# EasyEDA Pro project 16省.epro

# Schematic ESP_MCB_SCH

## Sheets
1 ESP32: Board Name: ESP_MCB; Create Date: 2025-03-12; Page Name: ESP32; Project Name: 16P1D_EDA; Schematic Name: ESP_MCB_SCH; Update Date: 2025-03-28; Company: 嘉立创EDA; Page Size: A4; Version: V1.0
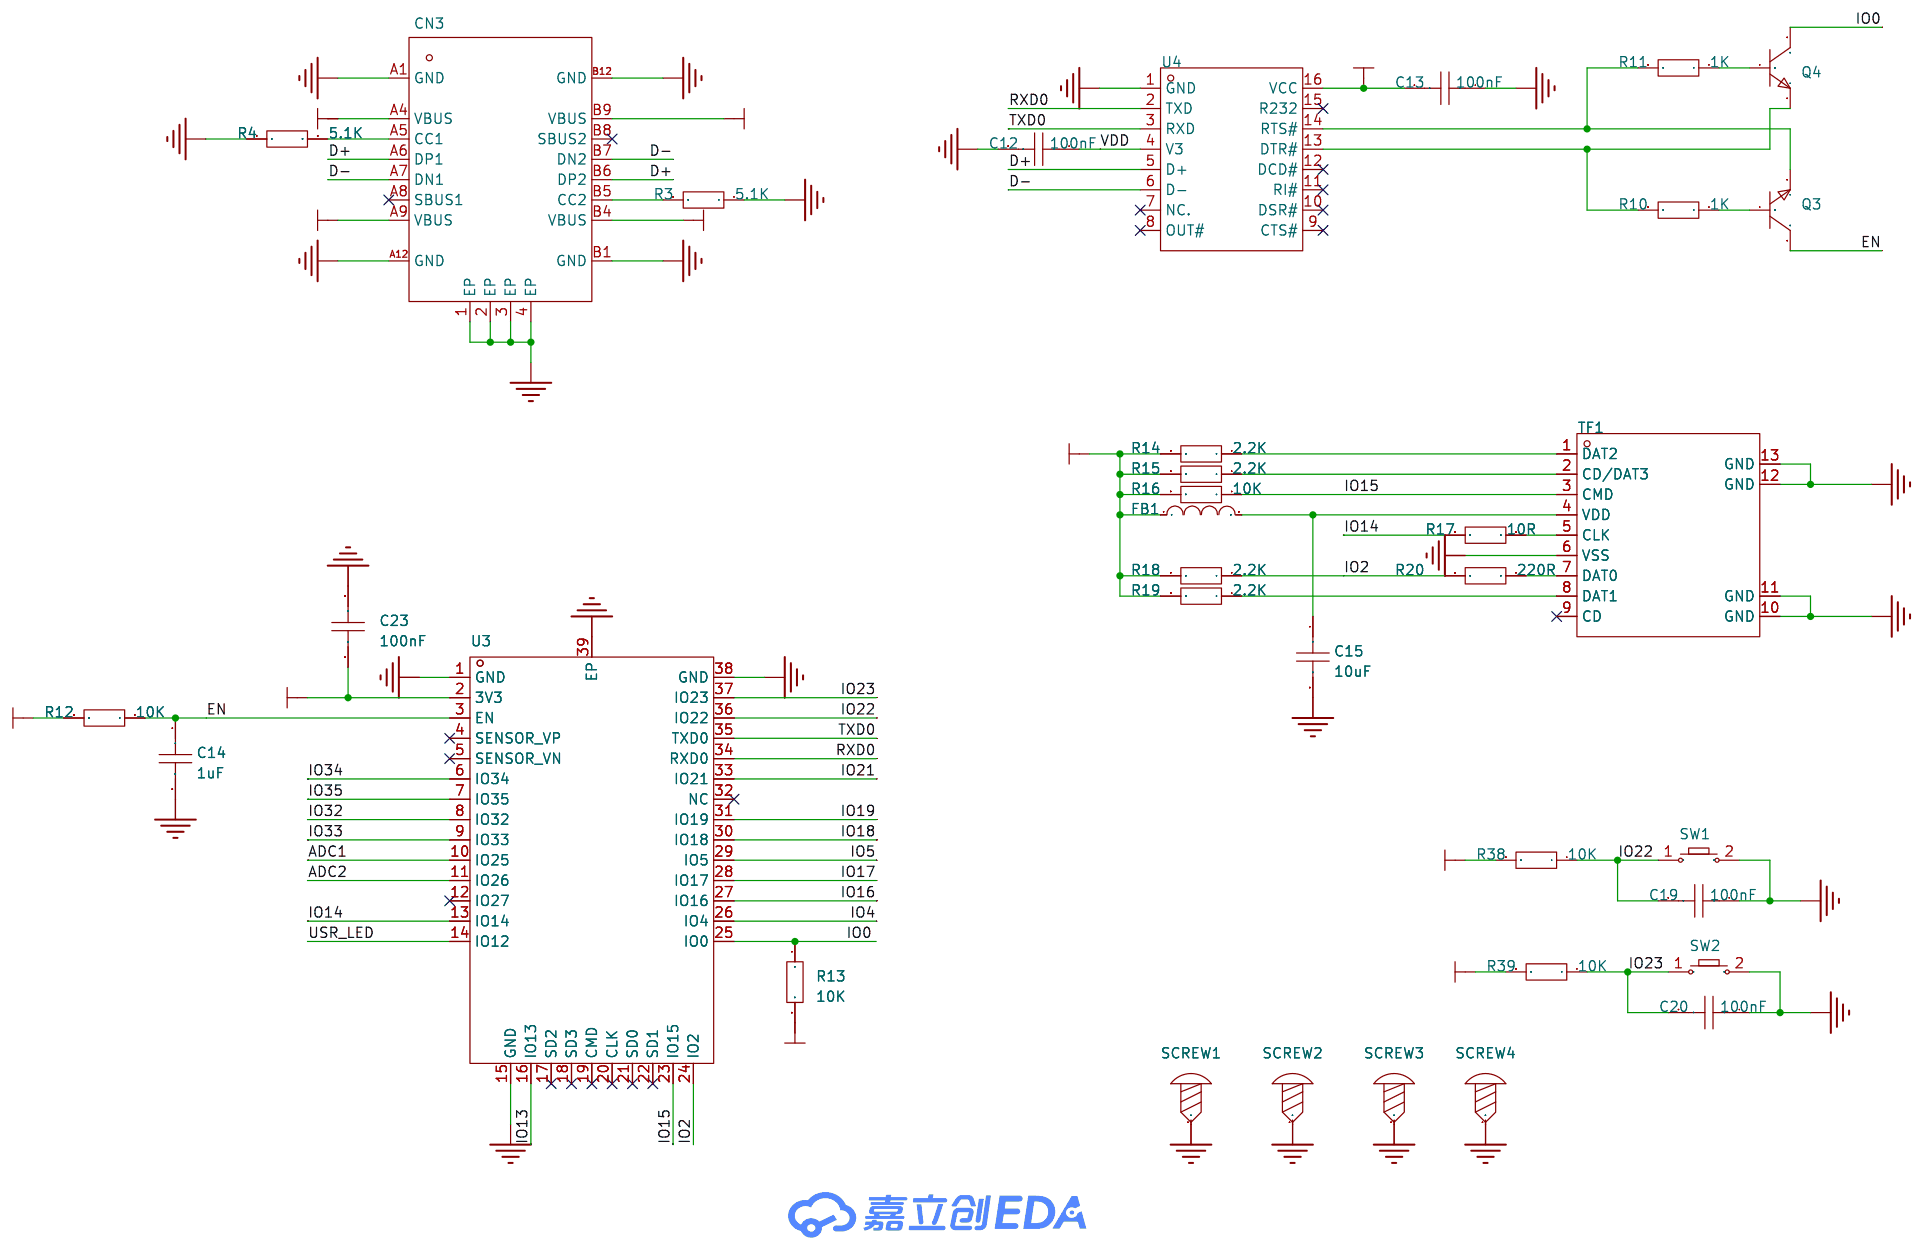
[diagram p0: ESP32]
2 DC: Page Name: DC; Update Date: 2025-03-13
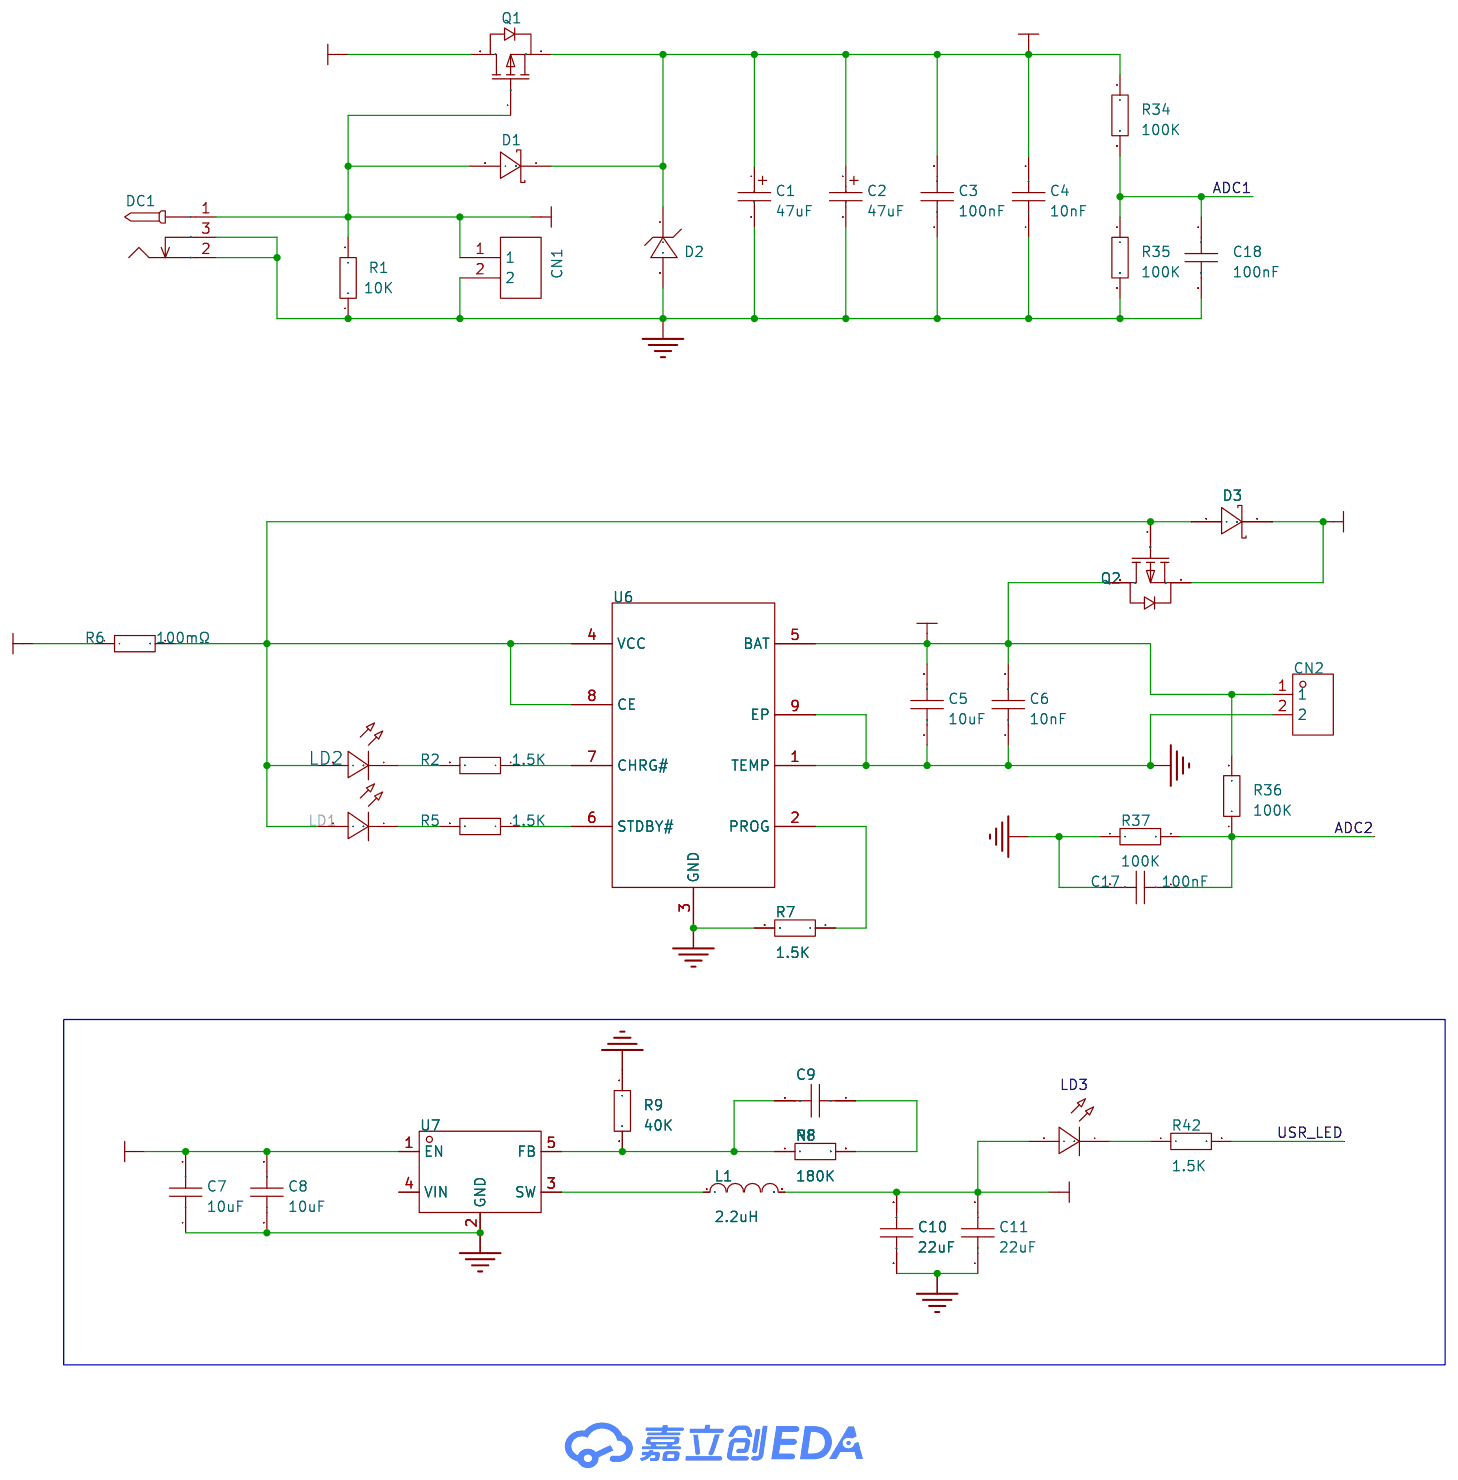
[diagram p1: DC]
3 RELAY: Page Name: RELAY
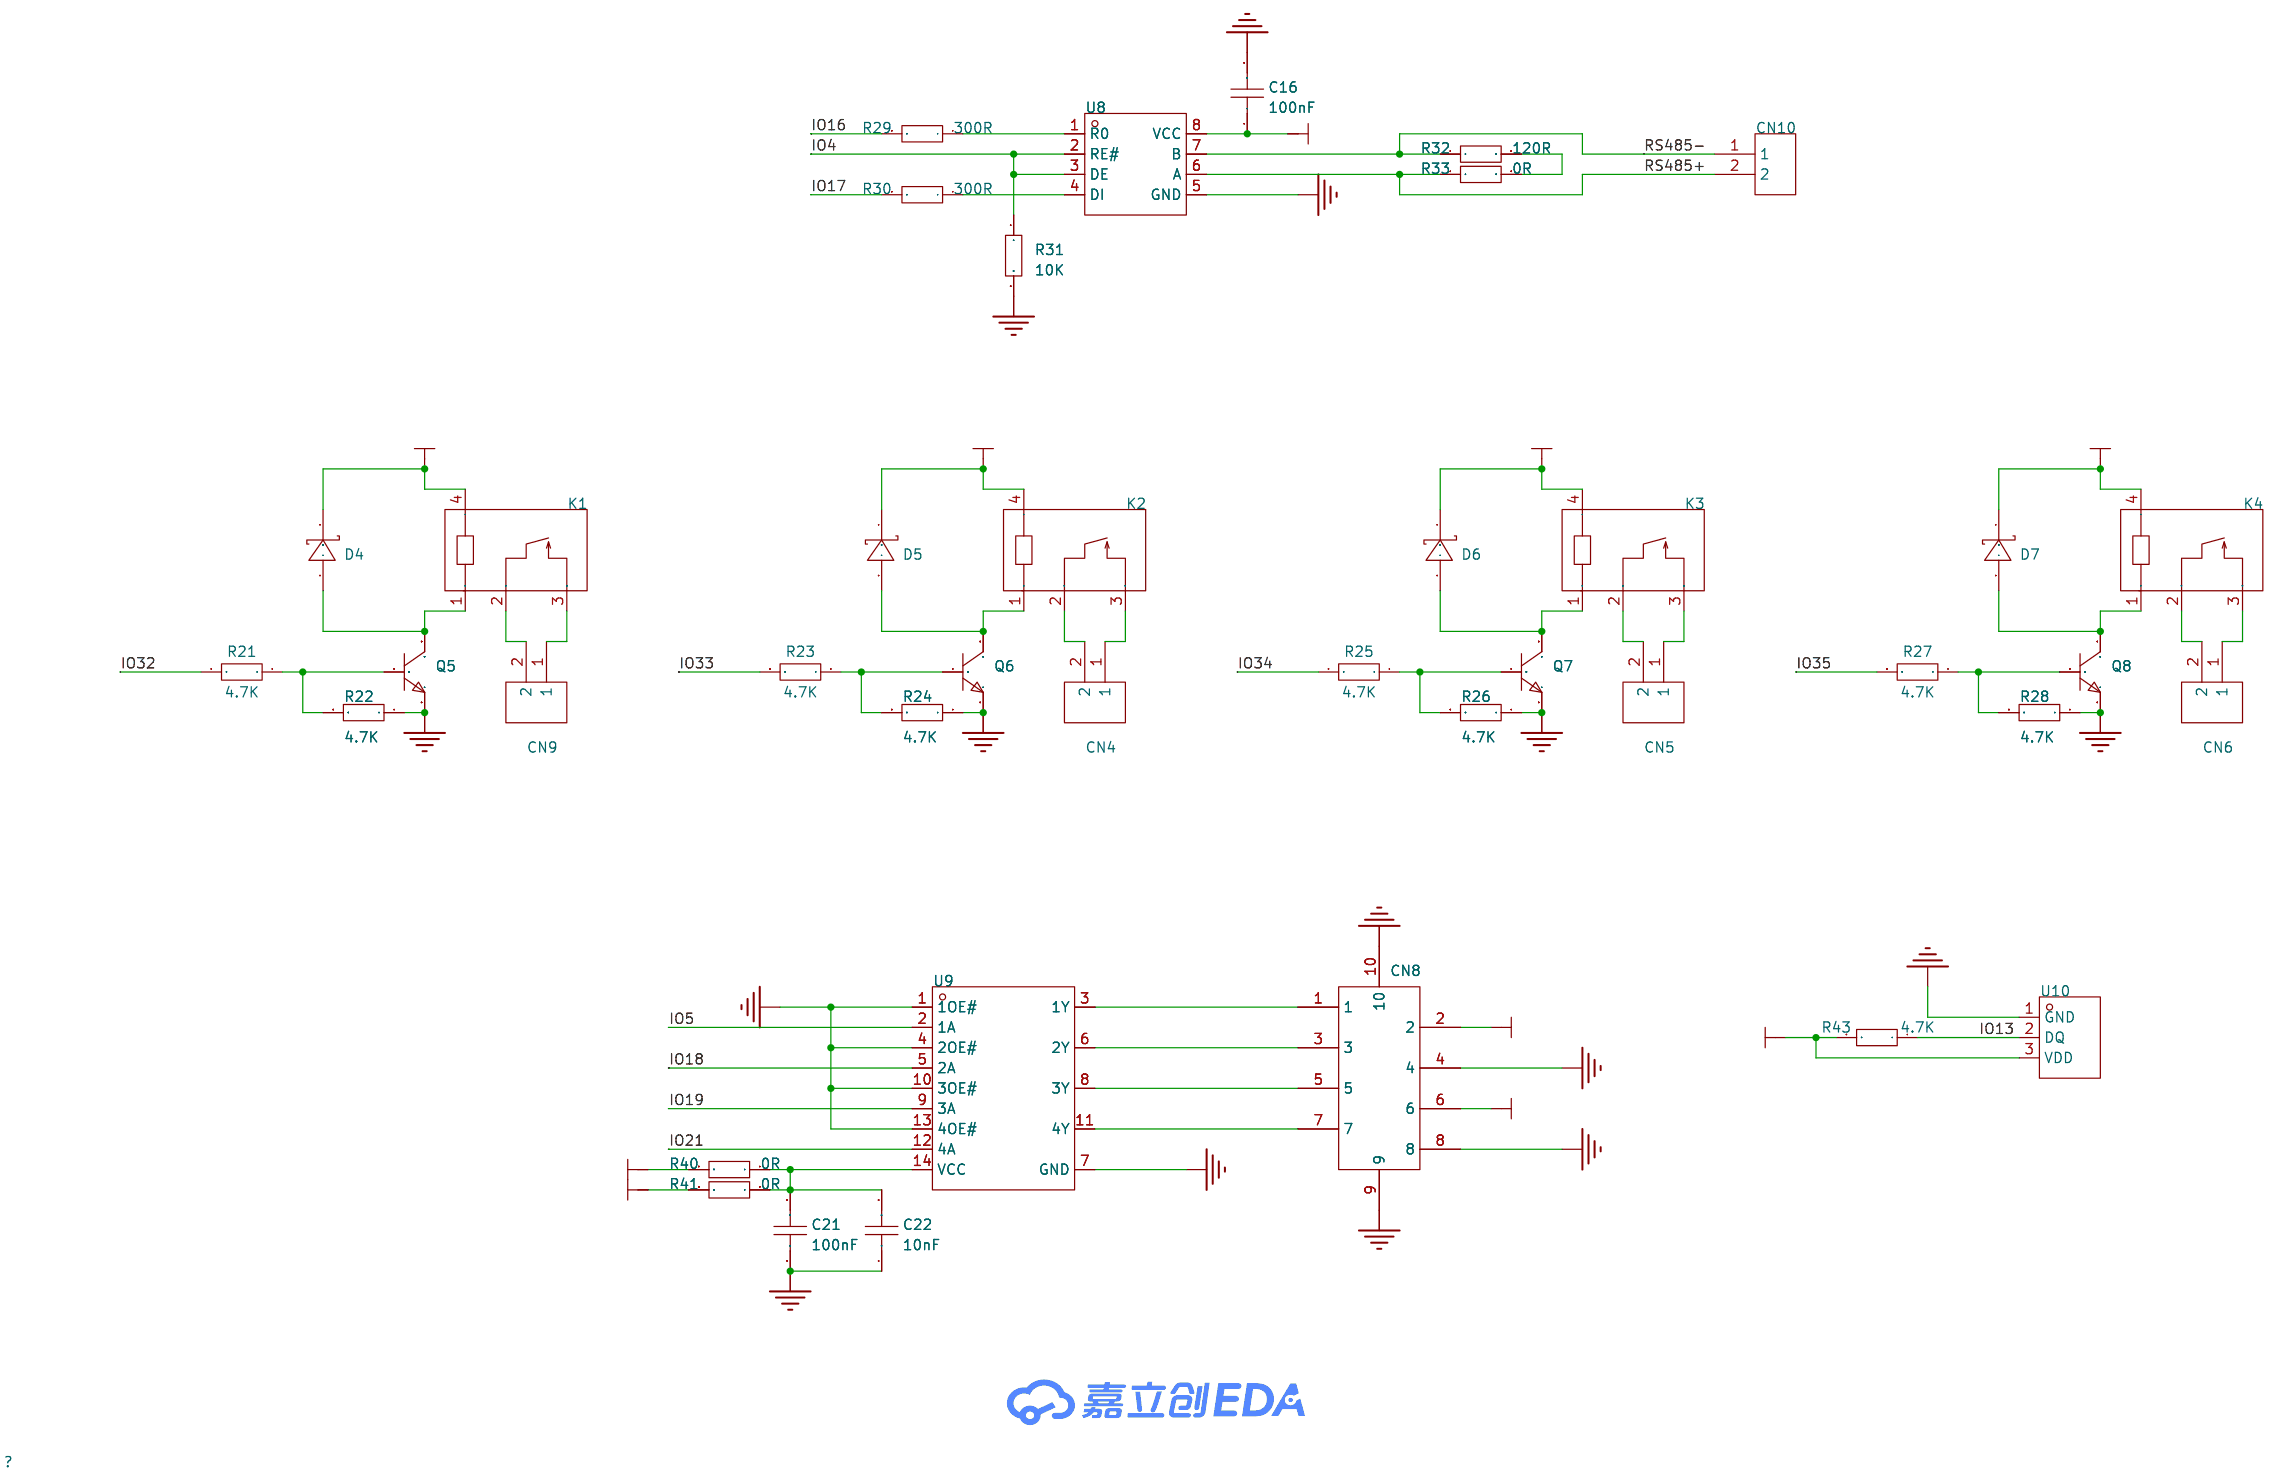
[diagram p2: RELAY]

## Parts
sheet DC
C1  47uF  [C_Ele_SMD_5x5.4mm]
C2  47uF  [C_Ele_SMD_5x5.4mm]
C3  100nF  [C0805]
C4  10nF  [C0805]
C5  10uF  [C0805]
C6  10nF  [C0805]
C7  10uF  [C0805]
C8  10uF  [C0805]
C9  NF  [C0805]
C10  22uF  [C0805]
C11  22uF  [C0805]
C17  100nF  [C0805]
C18  100nF  [C0805]
CN1  WJ500V-5.08-2P  [CONN-TH_2P-P5.00_WJ500V-5.08-2P]
CN2  ZX-XH2.54-2PZZ  [CONN-TH_2P-P2.50_HX25003-2A]
D1  SS34  [SMC_L6.9-W5.9-LS7.9-RD]
D2  SMBJ6.0A  [SMB_L4.6-W3.6-LS5.3-RD]
D3  SS34  [SMC_L6.9-W5.9-LS7.9-RD]
DC1  -  [DC-005_2.5]
L1  2.2uH  [IND-SMD_L4.4-W4.2]
LD1  -  [LED_0805]
LD2  -  [LED_0805]
LD3  -  [LED_0805]
Q1  AO3401A  [SOT-23_L2.9-W1.3-P1.90-LS2.4-BR]
Q2  AO3401A  [SOT-23_L2.9-W1.3-P1.90-LS2.4-BR]
R1  10K  [R0805]
R2  1.5K  [R0805]
R5  1.5K  [R0805]
R6  100mΩ  [R1210]
R7  1.5K  [R0805]
R8  180K  [R0805]
R9  40K  [R0805]
R34  100K  [R0805]
R35  100K  [R0805]
R36  100K  [R0805]
R37  100K  [R0805]
R42  1.5K  [R0805]
U6  TP4056-42-ESOP8  [ESOP-8_L4.9-W3.9-P1.27-LS6.0-BL-EP]
U7  -  [SOT_XDC]
sheet ESP32
C12  100nF  [C0805]
C13  100nF  [C0805]
C14  1uF  [C0805]
C15  10uF  [C0805]
C19  100nF  [C0805]
C20  100nF  [C0805]
C23  100nF  [C0805]
CN3  -  [USB_TYPE-C-16P]
FB1  10uH  [L0805]
Q3  SS8050  [SOT-23_L2.9-W1.3-P1.90-LS2.4-BR]
Q4  SS8050  [SOT-23_L2.9-W1.3-P1.90-LS2.4-BR]
R3  5.1K  [R0805]
R4  5.1K  [R0805]
R10  1K  [R0805]
R11  1K  [R0805]
R12  10K  [R0805]
R13  10K  [R0805]
R14  2.2K  [R0805]
R15  2.2K  [R0805]
R16  10K  [R0805]
R17  10R  [R0805]
R18  2.2K  [R0805]
R19  2.2K  [R0805]
R20  220R  [R0805]
R38  10K  [R0805]
R39  10K  [R0805]
SCREW1  -  [M2螺丝]
SCREW2  -  [M2螺丝]
SCREW3  -  [M2螺丝]
SCREW4  -  [M2螺丝]
SW1  -  [Key_SMD_3x4x2]
SW2  -  [Key_SMD_3x4x2]
TF1  TF-CARD H1.8  [TF-SMD_TF-CARD-H1.8]
U3  ESP32-WROOM-32  [WIFIM-SMD_ESP-WROOM-32]
U4  CH340C  [SOP-16_L10.0-W3.9-P1.27-LS6.0-BL]
sheet RELAY
C16  100nF  [C0805]
C21  100nF  [C0805]
C22  10nF  [C0805]
CN4  WJ500V-5.08-2P  [CONN-TH_2P-P5.00_WJ500V-5.08-2P]
CN5  WJ500V-5.08-2P  [CONN-TH_2P-P5.00_WJ500V-5.08-2P]
CN6  WJ500V-5.08-2P  [CONN-TH_2P-P5.00_WJ500V-5.08-2P]
CN8  8P-立贴带锁  [FPC-SMD_8P-P0.50_AFC11-S08ICC-00]
CN9  WJ500V-5.08-2P  [CONN-TH_2P-P5.00_WJ500V-5.08-2P]
CN10  WJ500V-5.08-2P  [CONN-TH_2P-P5.00_WJ500V-5.08-2P]
D4  SS34  [SMC_L6.9-W5.9-LS7.9-RD]
D5  SS34  [SMC_L6.9-W5.9-LS7.9-RD]
D6  SS34  [SMC_L6.9-W5.9-LS7.9-RD]
D7  SS34  [SMC_L6.9-W5.9-LS7.9-RD]
K1  G5NB-1A-E-12VDC  [RELAY-TH_G5NB-1A-E-DCXX]
K2  G5NB-1A-E-12VDC  [RELAY-TH_G5NB-1A-E-DCXX]
K3  G5NB-1A-E-12VDC  [RELAY-TH_G5NB-1A-E-DCXX]
K4  G5NB-1A-E-12VDC  [RELAY-TH_G5NB-1A-E-DCXX]
Q5  SS8050  [SOT-23_L2.9-W1.3-P1.90-LS2.4-BR]
Q6  SS8050  [SOT-23_L2.9-W1.3-P1.90-LS2.4-BR]
Q7  SS8050  [SOT-23_L2.9-W1.3-P1.90-LS2.4-BR]
Q8  SS8050  [SOT-23_L2.9-W1.3-P1.90-LS2.4-BR]
R21  4.7K  [R0805]
R22  4.7K  [R0805]
R23  4.7K  [R0805]
R24  4.7K  [R0805]
R25  4.7K  [R0805]
R26  4.7K  [R0805]
R27  4.7K  [R0805]
R28  4.7K  [R0805]
R29  300R  [R0805]
R30  300R  [R0805]
R31  10K  [R0805]
R32  120R  [R0805]
R33  0R  [R0805]
R40  0R  [R0805]
R41  0R  [R0805]
R43  4.7K  [R0805]
U8  MAX485EIM/TR  [SOP-8_L4.9-W3.9-P1.27-LS6.0-BL]
U9  74HC125D/S400118  [SOIC-14_L8.6-W3.8-P1.27-LS6.0-BL]
U10  GX18B20  [TO-92-3_L4.9-W3.7-P1.27-L]

## Library data of the parts
C1 C2 = C_Ele_SMD_5x5.4mm: Supplier Footprint: SMD,5x5.4mm
C3-C23 = CAP_0805: Supplier Footprint: 0805
CN1 CN4-CN6 CN9 CN10 = WJ500V-5.08-2P: 结构:1x2P;间距:5.08mm;颜色:绿色;安装方式:直插;额定电流:18A;额定电压:250V;排数:1;线规 - AWG:14~30;线规 - 平方毫米:2.5;每排PIN数:2;触头材质:-;触头镀层:-;工作温度范围:-40℃~+105℃;焊接温度(最大值):-;; LCSC Part Name: 1x2P 5.08mm 直插 排数:1 每排P数:2; Supplier Part: C8465; Manufacturer: KANGNEX(康奈克斯电气); Supplier Footprint: 插件,P=5.08mm; JLCPCB Part Class: 扩展库; Datasheet: https://atta.szlcsc.com/upload/public/pdf/source/20191225/C8465_02D34CE5B5B4A53DF5891601D97FA9F4.pdf; Supplier: LCSC; Structure: 1x2P; Pitch: 5.08mm; Color: 绿色; Mounting Style: 直插; Current Rating (Max): 18A; Voltage Rating (Max): 250V; Number of Pins: 2P; Number of Rows: 1; Wire Gauge - AWG: 14~30; Wire Gauge - mm2: 2.5; Number of PINs Per Row: 2; Operating Temperature Range: -40℃~+105℃; Screw Specification: M2.5
CN2 = ZX-XH2.54-2PZZ: 插针结构:1x2P;间距:2.5mm;安装方式:直插;参考系列:XH;总PIN数:2P;排数:1;每排PIN数:2;行距:-;额定电流:3A;触头材质:黄铜;触头镀层:锡;工作温度范围:-25℃~+85℃;; LCSC Part Name: 1x2P 间距:2.5mm 直插 系列:XH; Supplier Part: C7429632; Manufacturer: Megastar(兆星); Supplier Footprint: 插件,P=2.5mm; JLCPCB Part Class: 扩展库; Datasheet: https://atta.szlcsc.com/upload/public/pdf/source/20230619/19BA6947230AA44A04D3EDD65E618FD0.pdf; Supplier: LCSC; Pins Structure: 1x2P; Pitch: 2.5mm; Mounting Type: 直插; Reference Series: XH; Number of Pins: 2P; Number of Rows: 1; Number of PINs Per Row: 2; Rated Current: 3A; Contact Material: 黄铜; Contact Plating: 锡; Operating Temperature: -25℃~+85℃; Rated Voltage (Max): 250V; Plastic Material: PA66; Flame Retardant Rating: UL94V-0; Color: 白色; Z-Height of the Board: 7mm; X-Length of Bottom Edge on Board (Spacing Line): 7.5mm; Y-Width of Bottom Edge on Board: 5.9mm
D1 D3-D7 = SS34_C154551: 正向压降(Vf):500mV@3A;直流反向耐压(Vr):40V;整流电流:3A;; LCSC Part Name: 电压:40V 电流:3A; Supplier Part: C154551; Manufacturer: onsemi(安森美); Supplier Footprint: SMC(DO-214AB); JLCPCB Part Class: 扩展库; Datasheet: https://atta.szlcsc.com/upload/public/pdf/source/20230523/C977B907190B075B30FD168351032A84.pdf; Supplier: LCSC; Forward Voltage (Vf@If): 500mV@3A; Reverse Voltage (Vr): 40V; Rectified Current: 3A; Reverse Leakage Current (Ir): 500uA@40V
D2 = SMBJ6.0A_C2987966: 反向截止电压(Vrwm):6V;最大钳位电压:10.3V;峰值脉冲电流(Ipp)@10/1000us:58.3A;峰值脉冲功率(Ppp)@10/1000us:600W;击穿电压:6.67V;; Supplier Part: C2987966; Manufacturer: RUILON(瑞隆源); Supplier Footprint: SMB(DO-214AA); JLCPCB Part Class: 扩展库; Datasheet: https://atta.szlcsc.com/upload/public/pdf/source/20211010/C2833511_00578EBDCC8DA9F5F0AA6629F746BAEA.pdf; Supplier: LCSC; Reverse Stand-Off Voltage (Vrwm): 6V; Maximum Clamping Voltage: 10.3V; Peak Pulse Current (Ipp)@10/1000us: 58.3A; Peak Pulse Power Dissipation (Ppp)@10/1000us: 600W; Breakdown Voltage: 6.67V; Reverse Leakage Current (Ir): 800uA; Type: TVS
DC1 = DC-005_2.5: Supplier Footprint: 插件
L1 = FXL0420-2R2-M: 电感值:2.2uH;精度:±20%;额定电流:4.5A;饱和电流(Isat):5A;类型:一体成型电感;; LCSC Part Name: 2.2uH ±20% 5A; Supplier Part: C167206; Manufacturer: cjiang(长江微电); Supplier Footprint: SMD,4.2x4.4mm; JLCPCB Part Class: 扩展库; Datasheet: https://atta.szlcsc.com/upload/public/pdf/source/20240426/3189EA8206330E2108542F9E34E540E7.pdf; Supplier: LCSC; Tolerance: ±20%; Rated Current: 4.5A; Saturation Current (Isat): 5A; DC Resistance (DCR): 58mΩ; Type: 一体成型电感
LD1 = LED_0805-G: Supplier Footprint: 0805
LD2 = LED_0805-R: Supplier Footprint: 0805
LD3 = LED_0805-B: Supplier Footprint: 0805
Q1 Q2 = AO3401A_C15127: 类型:1个P沟道;漏源电压(Vdss):30V;连续漏极电流(Id):4A;导通电阻(RDS(on)@Vgs,Id):44mΩ@10V,4.3A;功率(Pd):1.4W;阈值电压(Vgs(th)@Id):1.3V@250uA;; LCSC Part Name: 1个P沟道 耐压:30V 电流:4A; Supplier Part: C15127; Manufacturer: AOS; Supplier Footprint: SOT-23; JLCPCB Part Class: 基础库; Datasheet: https://atta.szlcsc.com/upload/public/pdf/source/20160507/1462613609053.pdf; Supplier: LCSC; Type: 1个P沟道; Drain Source Voltage (Vdss): 30V; Continuous Drain Current (Id): 4A; Drain Source On Resistance (RDS(on)@Vgs,Id): 44mΩ@10V,4.3A; Power Dissipation (Pd): 1.4W; Gate Threshold Voltage (Vgs(th)@Id): 1.3V@250uA; Total Gate Charge (Qg@Vgs): 12.2nC@4.5V; Input Capacitance (Ciss@Vds): 1.2nF@15V; Operating Temperature: -55℃~+150℃@(Tj)
R1-R5 R7-R43 = Res_0805: Supplier Footprint: 0805
R6 = 1210W2F100LT5E: 电阻类型:厚膜电阻;阻值:100mΩ;精度:±1%;功率:500mW;最大工作电压:200V;温度系数:±800ppm/℃;; LCSC Part Name: 100mΩ ±1% 500mW 厚膜电阻; Supplier Part: C270892; Manufacturer: UNI-ROYAL(厚声); Supplier Footprint: 1210; JLCPCB Part Class: 扩展库; Datasheet: https://atta.szlcsc.com/upload/public/pdf/source/20200306/C422600_1E6D84923E4A46A82E41ADD87F860B5C.pdf; Supplier: LCSC; Type: 厚膜电阻; Tolerance: ±1%; Power(Watts): 500mW; Overload Voltage (Max): 200V; Temperature Coefficient: ±800ppm/℃; Operating Temperature Range: -55℃~+155℃
U6 = TP4056-42-ESOP8: 锂电池充电芯片 42代表电池满电电压4.2V。; Supplier Part: C16581; Manufacturer: TOPPOWER(南京拓微); Supplier Footprint: ESOP-8; JLCPCB Part Class: 扩展库; Datasheet: https://atta.szlcsc.com/upload/public/pdf/source/20190626/C16581_611BCF5D7CF554EAE465137A8F68DB3E.pdf; Supplier: LCSC
U7 = XDC
CN3 = USB_TYPE-C-16P: Supplier Footprint: SMD
FB1 = L_0805
Q3-Q8 = SS8050_C7420370: 晶体管类型:NPN;集电极电流(Ic):1.5A;集射极击穿电压(Vceo):25V;功率(Pd):300mW;直流电流增益(hFE@Ic,Vce):120@100mA,1.0V;; LCSC Part Name: 耐压:25V 电流:1.5A NPN H档 200-350; Supplier Part: C7420370; Manufacturer: 宏迦橙; Supplier Footprint: SOT-23; JLCPCB Part Class: 扩展库; Datasheet: https://atta.szlcsc.com/upload/public/pdf/source/20231222/9C4050A7669EB24B3ACD0418218817FD.pdf; Supplier: LCSC; Transistor Type: NPN; Collector Current (Ic): 1.5A; Collector-Emitter Breakdown Voltage (Vceo): 25V; Power Dissipation (Pd): 300mW; DC Current Gain (hFE@Ic,Vce): 120@100mA,1.0V; Transition Frequency (fT): 100MHz; Collector Cut-Off Current (Icbo): 100nA; Collector-Emitter Saturation Voltage (VCE(sat)@Ic,Ib): 500mV@800mA,80mA; Operating Temperature: -55℃~+150℃
SCREW1-SCREW4 = M2螺丝: Supplier Footprint: 插件
SW1 SW2 = Key_SMD_3x4x2: Supplier Footprint: SMD
TF1 = TF-CARD H1.8: 卡连接方式:自弹式;卡类型:MicroSD卡(TF卡);连接器类型:卡座;本体最大高度:1.8mm;工作温度范围:-40℃~+70℃;; LCSC Part Name: 自弹式 MicroSD卡(TF卡) 卡座; Supplier Part: C7529389; Manufacturer: SHOU HAN(首韩); Supplier Footprint: SMD; JLCPCB Part Class: 扩展库; Datasheet: https://atta.szlcsc.com/upload/public/pdf/source/20230818/611DB5E7B45C91025B0B37F957961A64.pdf; Supplier: LCSC; Card Connection Mode: 自弹式; Card Type: MicroSD卡(TF卡); Connector Type: 卡座; Maximum Body Height: 1.8mm; Operating Temperature Range: -40℃~+70℃
U3 = ESP32-WROOM-32: WiFi+双模蓝牙 双核CPU 网口 顶配MCU 低功耗蓝牙 ESP32系列ESP-WROOM-32模组/ESP-32S 4MB; Supplier Part: C95209; Manufacturer: ESPRESSIF(乐鑫); JLCPCB Part Class: 扩展库; Datasheet: https://atta.szlcsc.com/upload/public/pdf/source/20170925/C95209_1506321763821990573.pdf; Supplier: LCSC
U4 = CH340C: 应用功能:收发器;接口协议:USB 2.0;数据速率:2Mbps;; LCSC Part Name: CH340C USB转串口芯片 CH340; Supplier Part: C84681; Manufacturer: WCH(南京沁恒); Supplier Footprint: SOP-16; JLCPCB Part Class: 扩展库; Datasheet: https://atta.szlcsc.com/upload/public/pdf/source/20240619/63986D8440D4E5267A77ACD891CC4DE3.pdf; Supplier: LCSC; Applications Function: 收发器; Protocol: USB 2.0; Supply Voltage: 3.3V；5V; Data Rate: 2Mbps
CN8 = 8P-立贴带锁: Supplier Part: C9900019730; Supplier Footprint: FPC-SMD_8P-P0.50; JLCPCB Part Class: 扩展库; Supplier: LCSC
K1-K4 = G5NB-1A-E-12VDC: Supplier Part: C9900015445; Supplier Footprint: RELAY-TH; JLCPCB Part Class: 扩展库; Supplier: LCSC
U8 = MAX485EIM/TR: MAX485是一款用于RS-485和RS-422通信的低功耗收发器。IC包含一个驱动器和一个接收器，支持高达2.5Mbps的数据速率。; LCSC Part Name: 低功耗、限斜率RS-485/RS-422收发器; Supplier Part: C519080; Manufacturer: HGSEMI(华冠); Supplier Footprint: SOP-8; JLCPCB Part Class: 扩展库; Datasheet: https://atta.szlcsc.com/upload/public/pdf/source/20200603/C519080_72B67520E7E5436CB4A0FBE085BFDF15.pdf; Supplier: LCSC
U9 = 74HC125D/S400118: 电源电压:2V~6V;每个元件位数:1;灌电流(IOL):7.8mA;拉电流(IOH):7.8mA;; Supplier Part: C3756553; Manufacturer: Nexperia(安世); Supplier Footprint: SO-14; JLCPCB Part Class: 扩展库; Datasheet: https://atta.szlcsc.com/upload/public/pdf/source/20240116/E75C32AE9AD810C0A731227E1DE6BA82.pdf; Supplier: LCSC; output type: 三态; Supply Voltage: 2V~6V; Number of Bits per Element: 1; Sink Current: 7.8mA; Source Current: 7.8mA; Logic Family: 74HC; Operating Temperature: -40℃~+125℃
U10 = GX18B20: 传感器类型:-;输出类型:-;局部感温:-;远程感温:-;分辨率:-;; Supplier Part: C472471; Manufacturer: GXCAS(中科银河芯); Supplier Footprint: TO-92; JLCPCB Part Class: Extended Part; Datasheet: https://atta.szlcsc.com/upload/public/pdf/source/20191223/C472471_5F454D6116551F3002EC8C6787AA9F75.pdf; Supplier: LCSC

## Nets
GND: C1.2 C2.2 C3.1 C4.1 C5.1 C6.1 C7.1 C8.1 C10.1 C11.1 C12.2 C13.1 C14.2 C15.2 C16.2 C17.2 C18.2 C19.1 C20.1 C21.1 C22.1 C23.2 CN1.2 CN2.2 CN3.1(EP) CN3.2(EP) CN3.3(EP) CN3.4(EP) CN3.A1(GND) CN3.A12(GND) CN3.B1(GND) CN3.B12(GND) CN8.4 CN8.8 CN8.9 CN8.10 D2.2 DC1.2 DC1.3 Q5.2(E) Q6.2(E) Q7.2(E) Q8.2(E) R1.1 R3.1 R4.1 R7.2 R9.1 R22.1 R24.1 R26.1 R28.1 R31.2 R35.2 R37.1 SCREW1.1 SCREW2.1 SCREW3.1 SCREW4.1 SW1.2 SW2.2 TF1.6(VSS) TF1.10(GND) TF1.11(GND) TF1.12(GND) TF1.13(GND) U3.1(GND) U3.15(GND) U3.38(GND) U3.39(EP) U4.1(GND) U6.1(TEMP) U6.3(GND) U6.9(EP) U7.2(GND) U8.5(GND) U9.1(1OE#) U9.4(2OE#) U9.7(GND) U9.10(3OE#) U9.13(4OE#) U10.1(GND)
VBAT: C5.2 C6.2 CN2.1 Q2.3(D) R36.2 U6.5(BAT)
VBUS: CN3.A4(VBUS) CN3.A9(VBUS) CN3.B4(VBUS) CN3.B9(VBUS) Q1.3(D)
VDD: C10.2 C11.2 C12.1 C13.2 C16.1 C23.1 CN8.6 FB1.1 L1.2 LD3.2(A) R12.2 R13.2 R14.2 R15.2 R16.2 R18.2 R19.2 R38.2 R39.2 R41.2 R43.2 U3.2(3V3) U4.4(V3) U4.16(VCC) U8.8(VCC) U10.3(VDD)
ADC1: C18.1 R34.2 R35.1 U3.10(IO25)
ADC2: C17.1 R36.1 R37.2 U3.11(IO26)
D+: CN3.A6(DP1) CN3.B6(DP2) U4.5(D+)
D-: CN3.A7(DN1) CN3.B7(DN2) U4.6(D-)
EN: C14.1 Q3.3(C) R12.1 U3.3(EN)
IO0: Q4.3(C) R13.1 U3.25(IO0)
IO2: R18.1 R20.2 U3.24(IO2)
IO4: R31.1 U3.26(IO4) U8.2(RE#) U8.3(DE)
IO5: U3.29(IO5) U9.2(1A)
IO13: R43.1 U3.16(IO13) U10.2(DQ)
IO14: R17.2 U3.13(IO14)
IO15: R16.1 TF1.3(CMD) U3.23(IO15)
IO16: R29.2 U3.27(IO16)
IO17: R30.2 U3.28(IO17)
IO18: U3.30(IO18) U9.5(2A)
IO19: U3.31(IO19) U9.9(3A)
IO21: U3.33(IO21) U9.12(4A)
IO22: C19.2 R38.1 SW1.1 U3.36(IO22)
IO23: C20.2 R39.1 SW2.1 U3.37(IO23)
IO32: R21.2 U3.8(IO32)
IO33: R23.2 U3.9(IO33)
IO34: R25.2 U3.6(IO34)
IO35: R27.2 U3.7(IO35)
RS485+: CN10.2 R33.1 U8.6(A)
RS485-: CN10.1 R32.1 U8.7(B)
RXD0: U3.34(RXD0) U4.2(TXD)
TXD0: U3.35(TXD0) U4.3(RXD)
USR_LED: R42.2 U3.14(IO12)
V_EXT: CN1.1 D1.2(A) DC1.1(4) Q1.1(G) R1.2
VDC: C7.2 C8.2 D3.1(C) Q2.2(S) U7.1(EN)
VEXT: C1.1 C2.1 C3.2 C4.2 CN8.2 D1.1(C) D2.1 D4.1(C) D5.1(C) D6.1(C) D7.1(C) K1.4 K2.4 K3.4 K4.4 Q1.2(S) R6.1 R34.1 R40.2
$1N2320: CN3.B5(CC2) R3.2
$1N2381: CN3.A5(CC1) R4.2
$1N5837: Q3.2(E) R11.2 U4.14(RTS#)
$1N5841: Q4.2(E) R10.2 U4.13(DTR#)
$1N5844: Q4.1(B) R11.1
$1N5846: Q3.1(B) R10.1
$1N6425: R14.1 TF1.1(DAT2)
$1N6456: R15.1 TF1.2(CD/DAT3)
$1N6566: C15.1 FB1.2 TF1.4(VDD)
$1N6650: R17.1 TF1.5(CLK)
$1N6781: R19.1 TF1.8(DAT1)
$1N6830: R20.1 TF1.7(DAT0)
$2N2543: LD2.1(C) R2.2
$2N2544: LD1.1(C) R5.2
$2N2545: R5.1 U6.6(STDBY#)
$2N2546: R2.1 U6.7(CHRG#)
$2N2547: D3.2(A) LD1.2(A) LD2.2(A) Q2.1(G) R6.2 U6.4(VCC) U6.8(CE)
$2N2548: R7.1 U6.2(PROG)
$2N8434: C9.2 R8.1 R9.2 U7.5(FB)
$2N8460: C9.1 R8.2
$2N8471: L1.1 U7.3(SW)
$2N8543: LD3.1(C) R42.1
$3N357: D4.2(A) K1.1 Q5.3(C)
$3N404: Q5.1(B) R21.1 R22.2
$3N563: CN9.1 K1.3
$3N568: CN9.2 K1.2
$3N810: Q6.1(B) R23.1 R24.2
$3N823: D5.2(A) K2.1 Q6.3(C)
$3N828: CN4.1 K2.3
$3N831: CN4.2 K2.2
$3N1300: Q7.1(B) R25.1 R26.2
$3N1313: D6.2(A) K3.1 Q7.3(C)
$3N1318: CN5.1 K3.3
$3N1321: CN5.2 K3.2
$3N1326: Q8.1(B) R27.1 R28.2
$3N1339: D7.2(A) K4.1 Q8.3(C)
$3N1344: CN6.1 K4.3
$3N1347: CN6.2 K4.2
$3N1624: R29.1 U8.1(R0)
$3N1654: R30.1 U8.4(DI)
$3N1923: R32.2 R33.2
$3N3583: C21.2 C22.2 R40.1 R41.1 U9.14(VCC)
$3N3776: CN8.1 U9.3(1Y)
$3N3780: CN8.3 U9.6(2Y)
$3N3785: CN8.5 U9.8(3Y)
$3N3790: CN8.7 U9.11(4Y)

Not connected (* = marked no-connect by the designer): CN3 A8(SBUS1)* B8(SBUS2)*; TF1 9(CD)*; U3 4(SENSOR_VP)* 5(SENSOR_VN)* 12(IO27)* 17(SD2)* 18(SD3)* 19(CMD)* 20(CLK)* 21(SD0)* 22(SD1)* 32(NC)*; U4 7(NC.)* 8(OUT#)* 9(CTS#)* 10(DSR#)* 11(RI#)* 12(DCD#)* 15(R232)*; U7 4(VIN)

# Board ESP_MCB_PCB
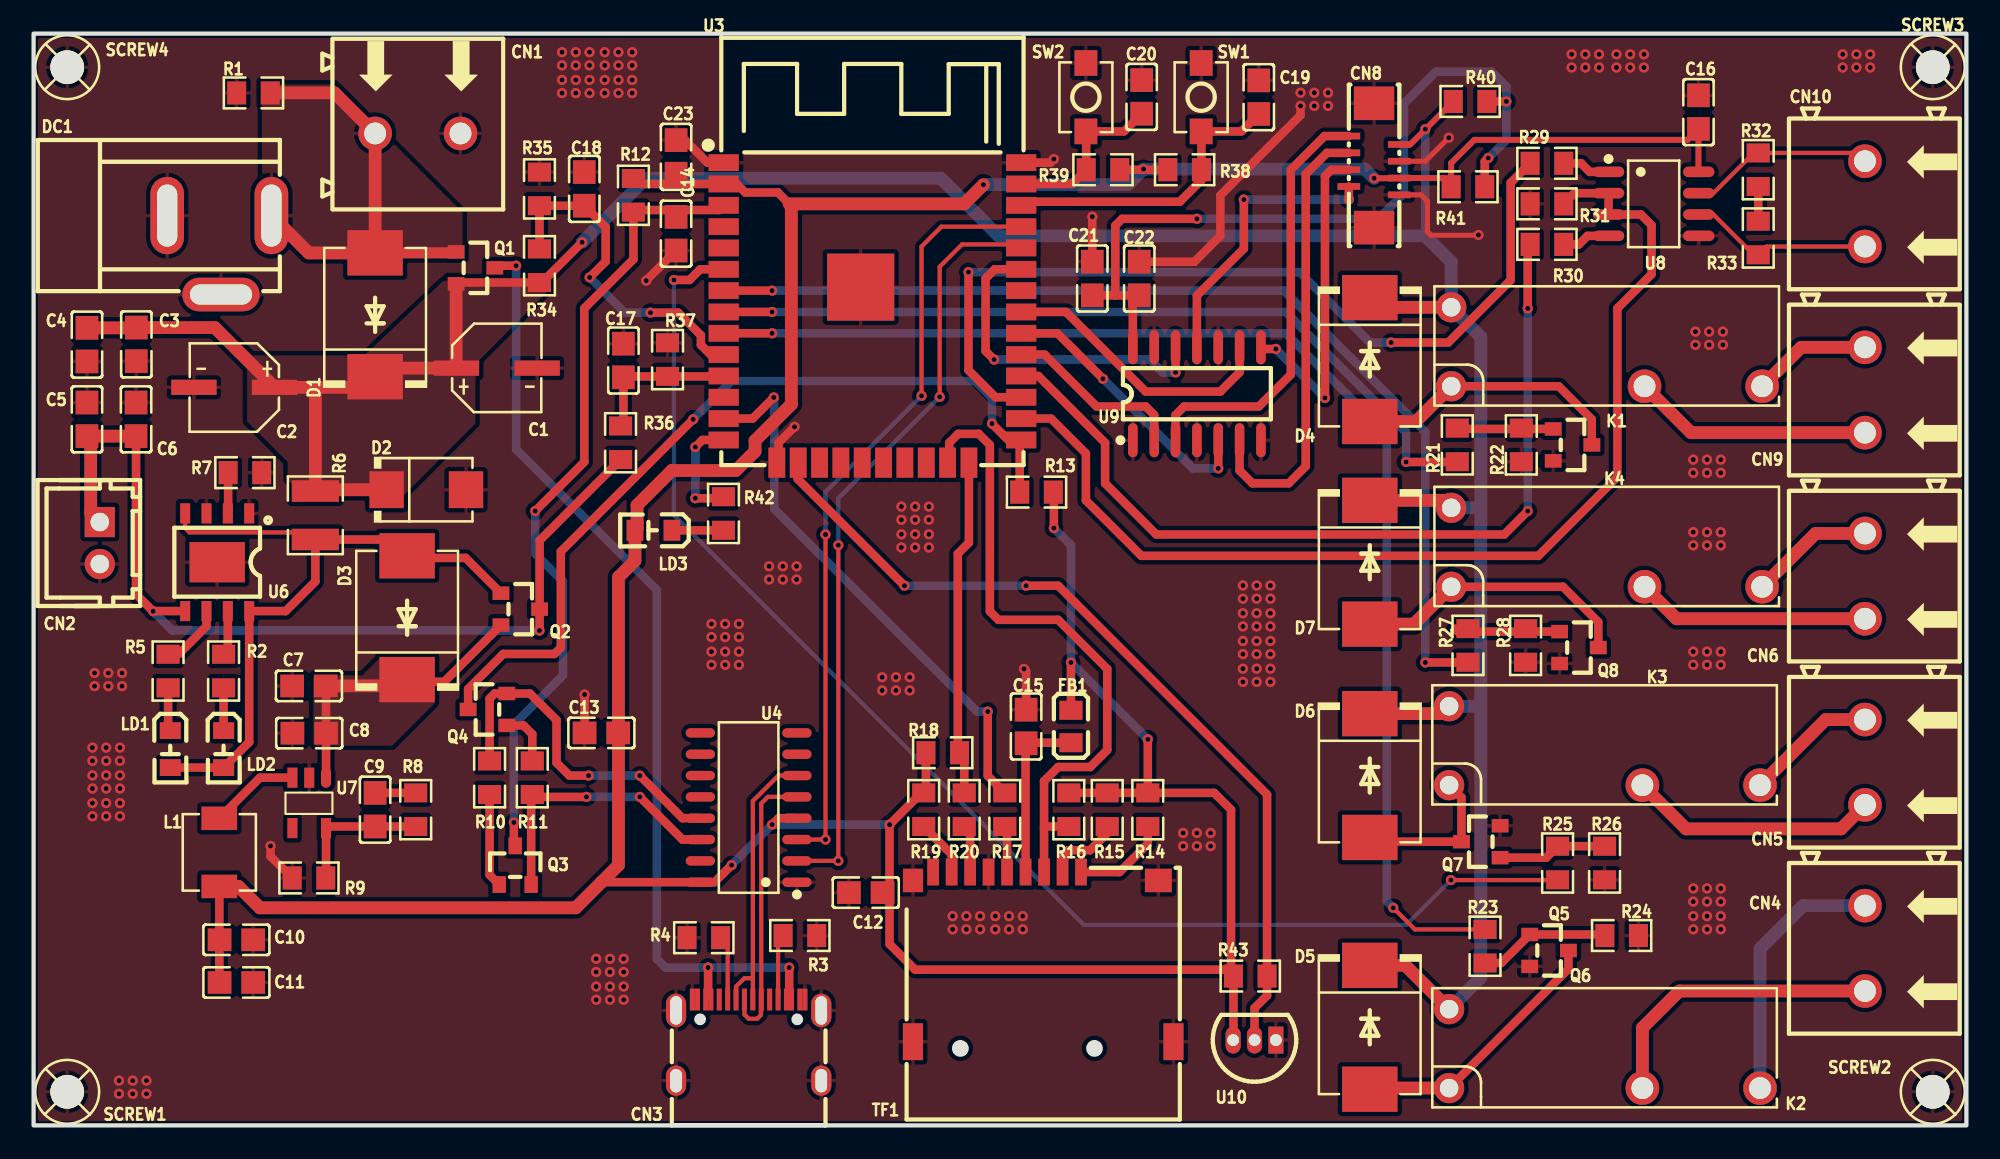
[diagram p3: board, top side]
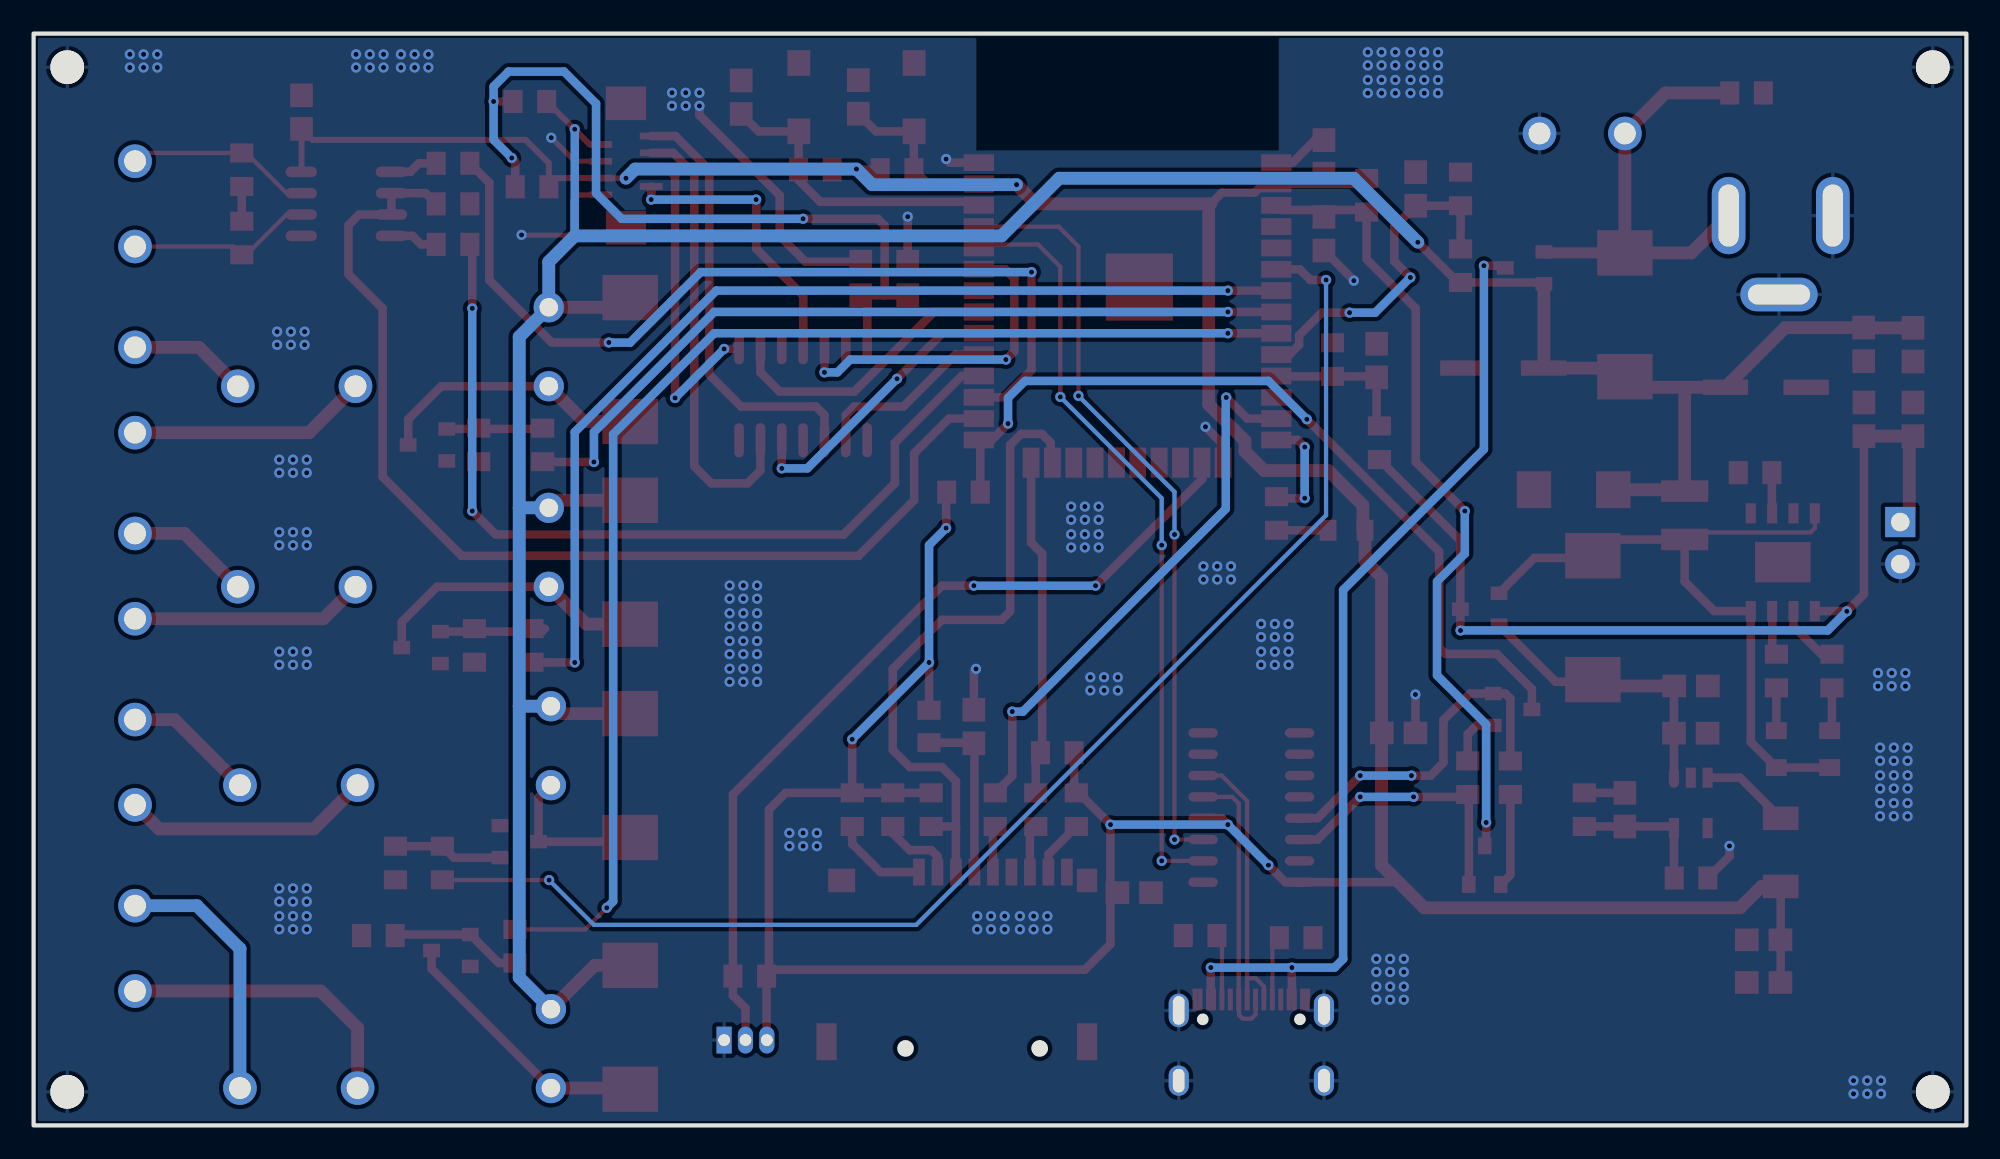
[diagram p4: board, bottom side, seen from below]

Outline 115 x 65 mm; copper layers: Top Layer, Bottom Layer. Coordinates in mm from the lower left corner of the outline.
Outline path: rectangle 0,0 115,65
Stack: Top Layer 0.035mm / Dielectric1 1.51mm FR4 er 4.5 / Bottom Layer 0.035mm

## Design rules (mm)
net D-: DP2
net D+: DP2
net RS485+: DP1
net RS485-: DP1
net RXD0: DP3
net TXD0: DP3
template: 自定义配置
spacing copperThickness1oz (default): track to track 0.203, other pairs 0.178 to 0.203
spacing copperThickness2oz: track to track 0.203, other pairs 0.152 to 0.3
track width copperThickness1oz (default): min 0.203, default 0.508, max 2.54
track width copperThickness2oz: min 0.203, default 0.254, max 2.54
differential pair differentialPair (default): width min 0.254, default 0.254, max 2.54; gap min 0.203, default 0.203
via viaSize (default): diameter min 0.508, default 0.61, max 10; hole min 0.254, default 0.305, max 6.299
net VEXT uses copperRegion1
pour e5479 uses copperRegion1
pour e5502 uses copperRegion1

## Placement (name value [footprint] x y rotation side)
C1  47uF  [C_Ele_SMD_5x5.4mm]  27.56 45.08 0 top
C2  47uF  [C_Ele_SMD_5x5.4mm]  11.94 43.94 180 top
C3  100nF  [C0805]  6.11 46.5 90 top
C4  10nF  [C0805]  3.17 46.48 90 top
C5  10uF  [C0805]  3.17 42.04 270 top
C6  10nF  [C0805]  6.1 42.04 270 top
C7  10uF  [C0805]  16.38 26.16 0 top
C8  10uF  [C0805]  16.4 23.35 0 top
C9  NF  [C0805]  20.32 18.8 270 top
C10  22uF  [C0805]  12.06 11.05 180 top
C11  22uF  [C0805]  12.06 8.51 180 top
C12  100nF  [C0805]  49.51 13.86 180 top
C13  100nF  [C0805]  33.78 23.37 0 top
C14  1uF  [C0805]  38.23 53.09 270 top
C15  10uF  [C0805]  59.06 23.75 90 top
C16  100nF  [C0805]  99.06 60.33 90 top
C17  100nF  [C0805]  35.09 45.54 90 top
C18  100nF  [C0805]  32.77 55.75 90 top
C19  100nF  [C0805]  72.9 61.21 270 top
C20  100nF  [C0805]  65.93 61.23 270 top
C21  100nF  [C0805]  62.99 50.42 270 top
C22  10nF  [C0805]  65.79 50.42 270 top
C23  100nF  [C0805]  38.23 57.66 90 top
CN1  WJ500V-5.08-2P  [CONN-TH_2P-P5.00_WJ500V-5.08-2P]  22.86 59.06 0 top
CN2  ZX-XH2.54-2PZZ  [CONN-TH_2P-P2.50_HX25003-2A]  3.94 34.67 270 top
CN3  -  [USB_TYPE-C-16P]  42.42 5.08 0 top
CN4  WJ500V-5.08-2P  [CONN-TH_2P-P5.00_WJ500V-5.08-2P]  108.97 10.54 270 top
CN5  WJ500V-5.08-2P  [CONN-TH_2P-P5.00_WJ500V-5.08-2P]  108.97 21.62 270 top
CN6  WJ500V-5.08-2P  [CONN-TH_2P-P5.00_WJ500V-5.08-2P]  108.97 32.7 270 top
CN8  8P-立贴带锁  [FPC-SMD_8P-P0.50_AFC11-S08ICC-00]  79.76 57.15 270 top
CN9  WJ500V-5.08-2P  [CONN-TH_2P-P5.00_WJ500V-5.08-2P]  108.97 43.78 270 top
CN10  WJ500V-5.08-2P  [CONN-TH_2P-P5.00_WJ500V-5.08-2P]  108.97 54.86 270 top
D1  SS34  [SMC_L6.9-W5.9-LS7.9-RD]  20.32 48.26 90 top
D2  SMBJ6.0A  [SMB_L4.6-W3.6-LS5.3-RD]  23.37 37.85 0 top
D3  SS34  [SMC_L6.9-W5.9-LS7.9-RD]  22.22 30.23 90 top
D4  SS34  [SMC_L6.9-W5.9-LS7.9-RD]  79.5 45.59 270 top
D5  SS34  [SMC_L6.9-W5.9-LS7.9-RD]  79.5 5.84 270 top
D6  SS34  [SMC_L6.9-W5.9-LS7.9-RD]  79.5 20.83 270 top
D7  SS34  [SMC_L6.9-W5.9-LS7.9-RD]  79.5 33.53 270 top
DC1  -  [DC-005_2.5]  10.92 53.85 180 top
FB1  10uH  [L0805]  61.72 23.75 270 top
K1  G5NB-1A-E-12VDC  [RELAY-TH_G5NB-1A-E-DCXX]  93.6 46.36 0 top
K2  G5NB-1A-E-12VDC  [RELAY-TH_G5NB-1A-E-DCXX]  93.47 4.57 0 top
K3  G5NB-1A-E-12VDC  [RELAY-TH_G5NB-1A-E-DCXX]  93.47 22.61 0 top
K4  G5NB-1A-E-12VDC  [RELAY-TH_G5NB-1A-E-DCXX]  93.6 34.42 0 top
L1  2.2uH  [IND-SMD_L4.4-W4.2]  11.05 16.26 90 top
LD1  -  [LED_0805]  8.13 22.35 270 top
LD2  -  [LED_0805]  11.3 22.35 270 top
LD3  -  [LED_0805]  36.83 35.43 180 top
Q1  AO3401A  [SOT-23_L2.9-W1.3-P1.90-LS2.4-BR]  26.29 51.05 180 top
Q2  AO3401A  [SOT-23_L2.9-W1.3-P1.90-LS2.4-BR]  28.96 30.73 180 top
Q3  SS8050  [SOT-23_L2.9-W1.3-P1.90-LS2.4-BR]  28.66 15.49 270 top
Q4  SS8050  [SOT-23_L2.9-W1.3-P1.90-LS2.4-BR]  27 24.76 0 top
Q5  SS8050  [SOT-23_L2.9-W1.3-P1.90-LS2.4-BR]  91.57 40.51 180 top
Q6  SS8050  [SOT-23_L2.9-W1.3-P1.90-LS2.4-BR]  90.17 10.41 180 top
Q7  SS8050  [SOT-23_L2.9-W1.3-P1.90-LS2.4-BR]  86.11 16.89 0 top
Q8  SS8050  [SOT-23_L2.9-W1.3-P1.90-LS2.4-BR]  91.95 28.45 180 top
R1  10K  [R0805]  13.08 61.47 0 top
R2  1.5K  [R0805]  11.3 27.05 270 top
R3  5.1K  [R0805]  45.59 11.3 180 top
R4  5.1K  [R0805]  39.88 11.18 0 top
R5  1.5K  [R0805]  8 27.05 270 top
R6  100mΩ  [R1210]  16.76 36.32 270 top
R7  1.5K  [R0805]  12.57 38.86 0 top
R8  180K  [R0805]  22.73 18.8 90 top
R9  40K  [R0805]  16.38 14.73 0 top
R10  1K  [R0805]  27.13 20.7 90 top
R11  1K  [R0805]  29.67 20.7 270 top
R12  10K  [R0805]  35.69 55.37 90 top
R13  10K  [R0805]  59.67 37.7 0 top
R14  2.2K  [R0805]  66.29 18.8 90 top
R15  2.2K  [R0805]  63.88 18.8 90 top
R16  10K  [R0805]  61.59 18.8 90 top
R17  10R  [R0805]  57.78 18.8 90 top
R18  2.2K  [R0805]  54.09 22.19 180 top
R19  2.2K  [R0805]  52.96 18.8 90 top
R20  220R  [R0805]  55.37 18.8 90 top
R21  4.7K  [R0805]  84.71 40.51 270 top
R22  4.7K  [R0805]  88.52 40.51 90 top
R23  4.7K  [R0805]  86.36 10.67 90 top
R24  4.7K  [R0805]  94.49 11.3 180 top
R25  4.7K  [R0805]  90.68 15.62 270 top
R26  4.7K  [R0805]  93.47 15.62 90 top
R27  4.7K  [R0805]  85.34 28.58 270 top
R28  4.7K  [R0805]  88.77 28.58 90 top
R29  300R  [R0805]  90.04 57.28 180 top
R30  300R  [R0805]  90.04 52.45 180 top
R31  10K  [R0805]  90.04 54.86 180 top
R32  120R  [R0805]  102.62 56.9 270 top
R33  0R  [R0805]  102.62 52.83 90 top
R34  100K  [R0805]  30.1 51.18 90 top
R35  100K  [R0805]  30.1 55.75 90 top
R36  100K  [R0805]  34.92 40.64 270 top
R37  100K  [R0805]  37.72 45.59 270 top
R38  10K  [R0805]  68.49 56.9 180 top
R39  10K  [R0805]  63.63 56.9 0 top
R40  0R  [R0805]  85.47 60.96 180 top
R41  0R  [R0805]  85.34 55.88 180 top
R42  1.5K  [R0805]  41.05 36.43 90 top
R43  4.7K  [R0805]  72.39 8.89 180 top
SCREW1  -  [M2螺丝]  2 2 0 top
SCREW2  -  [M2螺丝]  113 2 0 top
SCREW3  -  [M2螺丝]  113 63 0 top
SCREW4  -  [M2螺丝]  2 63 0 top
SW1  -  [Key_SMD_3x4x2]  69.47 61.21 90 top
SW2  -  [Key_SMD_3x4x2]  62.61 61.21 90 top
TF1  TF-CARD H1.8  [TF-SMD_TF-CARD-H1.8]  60.07 10.03 0 top
U3  ESP32-WROOM-32  [WIFIM-SMD_ESP-WROOM-32]  49.91 48.39 0 top
U4  CH340C  [SOP-16_L10.0-W3.9-P1.27-LS6.0-BL]  42.54 18.92 90 top
U6  TP4056-42-ESOP8  [ESOP-8_L4.9-W3.9-P1.27-LS6.0-BL-EP]  10.92 33.53 180 top
U7  -  [SOT_XDC]  17.4 20.7 270 top
U8  MAX485EIM/TR  [SOP-8_L4.9-W3.9-P1.27-LS6.0-BL]  96.39 54.86 270 top
U9  74HC125D/S400118  [SOIC-14_L8.6-W3.8-P1.27-LS6.0-BL]  69.22 43.56 0 top
U10  GX18B20  [TO-92-3_L4.9-W3.7-P1.27-L]  72.64 5.08 180 top

## Footprints (pads in the part's own frame, mm; a bottom-side part is the same pattern mirrored in y, then rotated)
C0805
  rect 1.41x1.35 smd: 1(-1,0) 2(1,0)
C_Ele_SMD_5x5.4mm
  rect 2.7x0.91 smd: 1(-2.4,0) 2(2.4,0)
CONN-TH_2P-P2.50_HX25003-2A
  rect 1.8x1.8 hole 1.1: 1(-1.25,0)
  round 1.8 hole 1.1: 2(1.25,0)
CONN-TH_2P-P5.00_WJ500V-5.08-2P
  round 2 hole 1.3: 1(-2.54,0) 2(2.54,0)
DC-005_2.5
  oval 2x4.6 hole 1.2x3.7: 1(-3.227,-0.318) 2(2.973,-0.318)
  oval 4.6x2 hole 3.7x1.2: 3(-0.227,4.382)
ESOP-8_L4.9-W3.9-P1.27-LS6.0-BL-EP
  rect 0.6x1.2 smd: 1(-1.905,-2.909) 2(-0.635,-2.909) 3(0.635,-2.909) 4(1.905,-2.909) 5(1.905,2.909) 6(0.635,2.909) 7(-0.635,2.909) 8(-1.905,2.909)
  rect 3.3x2.4 smd: 9(0,0)
FPC-SMD_8P-P0.50_AFC11-S08ICC-00
  rect 0.4x1.35 smd: 1(-1.75,-1.5) 2(-1.25,1.5) 3(-0.75,-1.5) 4(-0.25,1.5) 5(0.25,-1.5) 6(0.75,1.5) 7(1.25,-1.5) 8(1.75,1.5)
  rect 2x2.4 smd: 9(3.7,0) 10(-3.7,0)
IND-SMD_L4.4-W4.2
  rect 1.4x2.12 smd: 1(2.028,0) 2(-2.028,0)
Key_SMD_3x4x2
  rect 1.53x1.36 smd: 1(-2.035,0) 2(2.035,0)
L0805
  rect 1.133x1.377 smd: 1(-0.966,0) 2(0.966,0)
LED_0805
  rect 1x1.25 smd: 1(-1.15,0.005) 2(1.05,0.005)
M2螺丝
  round 2 hole 2: 1(0,0)
R0805
  rect 1.133x1.377 smd: 1(-1,0) 2(1,0)
R1210
  rect 1.282x2.808 smd: 1(-1.441,0) 2(1.441,0)
RELAY-TH_G5NB-1A-E-DCXX
  round 1.8 hole 1.1: 1(-9.25,-2.35) 4(-9.25,2.35)
  round 2 hole 1.3: 2(2.25,-2.35) 3(9.25,-2.35)
SMB_L4.6-W3.6-LS5.3-RD
  rect 2.047x2.192 smd: 1(-2.361,0) 2(2.361,0)
SMC_L6.9-W5.9-LS7.9-RD
  rect 2.7x3.3 smd: 1(-3.687,0) 2(3.687,0)
SOIC-14_L8.6-W3.8-P1.27-LS6.0-BL
  oval 0.574x2.038 smd: 1(-3.81,-2.769) 2(-2.54,-2.769) 3(-1.27,-2.769) 4(0,-2.769) 5(1.27,-2.769) 6(2.54,-2.769) 7(3.81,-2.769) 8(3.81,2.769) 9(2.54,2.769) 10(1.27,2.769) 11(0,2.769) 12(-1.27,2.769) 13(-2.54,2.769) 14(-3.81,2.769)
SOP-8_L4.9-W3.9-P1.27-LS6.0-BL
  oval 0.63x1.865 smd: 1(-1.905,-2.683) 2(-0.635,-2.683) 3(0.635,-2.683) 4(1.905,-2.683) 5(1.905,2.683) 6(0.635,2.683) 7(-0.635,2.683) 8(-1.905,2.683)
SOP-16_L10.0-W3.9-P1.27-LS6.0-BL
  oval 0.56x1.745 smd: 1(-4.445,-2.873) 2(-3.175,-2.873) 3(-1.905,-2.873) 4(-0.635,-2.873) 5(0.635,-2.873) 6(1.905,-2.873) 7(3.175,-2.873) 8(4.445,-2.873) 9(4.445,2.873) 10(3.175,2.873) 11(1.905,2.873) 12(0.635,2.873) 13(-0.635,2.873) 14(-1.905,2.873) 15(-3.175,2.873) 16(-4.445,2.873)
SOT-23_L2.9-W1.3-P1.90-LS2.4-BR
  rect 1x0.8 smd: 1(1.15,-0.95) 2(1.15,0.95) 3(-1.15,0)
SOT_XDC
  oval 1.2x0.6 smd: 1(0,0)
  rect 1.2x0.6 smd: 2(0,-1) 3(0,-2) 4(3,-2) 5(3,0)
TF-SMD_TF-CARD-H1.8
  rect 0.7x1.6 smd: 1(2.25,5.05) 2(1.15,5.05) 3(0.05,5.05) 4(-1.05,5.05) 5(-2.15,5.05) 6(-3.25,5.05) 7(-4.35,5.05) 8(-5.45,5.05) 9(-6.55,5.05)
  rect 1.2x1.4 smd: 10(-7.747,4.55)
  rect 1.2x2.2 smd: 11(-7.75,-5.05) 12(7.75,-5.05)
  rect 1.6x1.4 smd: 13(6.85,4.55)
TO-92-3_L4.9-W3.7-P1.27-L
  rect 0.9x1.6 hole 0.7: 1(-1.27,0)
  oval 0.9x1.6 hole 0.7: 2(0,0) 3(1.27,0)
USB_TYPE-C-16P
  oval 1.2x2 hole 0.7x1.7: 1(-4.193,1.765) 2(4.447,1.765)
  oval 1.2x1.8 hole 0.7x1.4: 3(-4.193,-2.415) 4(4.447,-2.415)
  rect 0.3x1.3 smd: A1(-3.223,2.415) A4(-2.423,2.415) A5(-1.123,2.415) A6(-0.123,2.415) A7(0.377,2.415) A8(1.377,2.415) A9(2.677,2.415) A12(3.477,2.415) B1(3.177,2.415) B4(2.377,2.415) B5(1.877,2.415) B6(0.877,2.415) B7(-0.623,2.415) B8(-1.623,2.415) B9(-2.123,2.415) B12(-2.923,2.415)
WIFIM-SMD_ESP-WROOM-32
  rect 1.8x1.001 smd: 1(-8.851,8.931) 2(-8.851,7.66) 3(-8.851,6.391) 4(-8.851,5.12) 5(-8.851,3.85) 6(-8.851,2.58) 7(-8.851,1.31) 8(-8.851,0.041) 9(-8.851,-1.23) 10(-8.851,-2.499) 11(-8.851,-3.769) 12(-8.851,-5.04) 13(-8.851,-6.309) 14(-8.851,-7.58) 25(8.851,-7.58) 26(8.851,-6.309) 27(8.851,-5.04) 28(8.851,-3.769) 29(8.851,-2.499) 30(8.851,-1.23) 31(8.851,0.041) 32(8.851,1.31) 33(8.851,2.58) 34(8.851,3.85) 35(8.851,5.12) 36(8.851,6.391) 37(8.851,7.66) 38(8.851,8.931)
  rect 1.001x1.8 smd: 15(-5.689,-8.931) 16(-4.42,-8.931) 17(-3.15,-8.931) 18(-1.879,-8.931) 19(-0.61,-8.931) 20(0.66,-8.931) 21(1.931,-8.931) 22(3.2,-8.931) 23(4.471,-8.931) 24(5.74,-8.931)
  rect 4x4 smd: 39(-0.7,1.52)

## Nets
As in the schematic.

Pads without a net: CN3 A8 B8; TF1 9; U3 4 5 12 17 18 19 20 21 22 32; U4 7 8 9 10 11 12 15; U7 4

## Via types
v1: diameter 0.61, hole 0.305, Top Layer to Bottom Layer, 274 vias

## Routing (per net, layer and track width the routed paths; a pad name or vN(x,y) marks a point on that pad's centre or on a via; arc(x,y) is an arc through that point)
GND: length 45.9
  Top Layer w0.305: CN8.4 82.8,57.4 v1(84.2,58.8) ; 85.98,53 83.15,53 82.93,53.21 82.93,55.02 82.55,55.4 CN8.8
  Top Layer w0.508: v1(75.38,60.69) 75.38,60.14 70.61,55.37 70.61,52.96 69.07,51.42 C22.1 ; C23.2 38.75,58.66 40.09,57.32 U3.1 ; v1(45.28,41.59) 44.32,40.64 44.32,39.56 U3.15 ; C14.2 36.45,50.31 v1(36.45,50.29) ; C13.1 v1(32.78,25.65) ; U3.38 60.49,57.32 v1(60.71,57.53) ; v1(58.93,27.18) 59.06,27.05 C15.2 ; C21.1 v1(62.99,54.1) ; v1(14.1,16.64) 14.1,16.02 R9.1
  vias: v1(3.5,22.49) v1(3.5,21.71) v1(3.5,20.84) v1(3.5,20.05) v1(3.5,19.19) v1(3.5,18.4) v1(3.63,26.94) v1(3.63,26.15) v1(4.32,22.49) v1(4.32,21.71) v1(4.32,20.84) v1(4.32,20.05) v1(4.32,19.19) v1(4.32,18.4) v1(4.44,26.94) v1(4.44,26.15) v1(5.14,22.49) v1(5.14,21.71) v1(5.14,20.84) v1(5.14,20.05) v1(5.14,19.19) v1(5.14,18.4) v1(5.08,2.67) v1(5.08,1.88) v1(5.26,26.94) v1(5.26,26.15) v1(5.9,2.67) v1(5.9,1.88) v1(6.72,2.67) v1(6.72,1.88) v1(31.44,63.89) v1(31.44,63.11) v1(31.44,62.24) v1(31.44,61.46) v1(32.26,63.89) v1(32.26,63.11) v1(32.26,62.24) v1(32.26,61.46) v1(33.08,63.89) v1(33.08,63.11) v1(33.08,62.24) v1(33.08,61.46) v1(33.47,9.92) v1(33.47,9.13) v1(33.47,8.27) v1(33.47,7.48) v1(33.98,63.89) v1(33.98,63.11) v1(33.98,62.24) v1(33.98,61.46) v1(34.29,9.92) v1(34.29,9.13) v1(34.29,8.27) v1(34.29,7.48) v1(34.8,63.89) v1(34.8,63.11) v1(34.8,62.24) v1(34.8,61.46) v1(35.11,9.92) v1(35.11,9.13) v1(35.11,8.27) v1(35.11,7.48) v1(35.62,63.89) v1(35.62,63.11) v1(35.62,62.24) v1(35.62,61.46) v1(40.33,29.86) v1(40.33,29.07) v1(40.33,28.21) v1(40.33,27.42) v1(41.15,29.86) v1(41.15,29.07) v1(41.15,28.21) v1(41.15,27.42) v1(41.97,29.86) v1(41.97,29.07) v1(41.97,28.21) v1(41.97,27.42) v1(43.76,33.29) v1(43.76,32.5) v1(44.58,33.29) v1(44.58,32.5) v1(45.4,33.29) v1(45.4,32.5) v1(50.49,26.68) v1(50.49,25.9) v1(51.31,26.68) v1(51.31,25.9) v1(51.63,36.84) v1(51.63,36.06) v1(51.63,35.19) v1(51.63,34.41) v1(52.13,26.68) v1(52.13,25.9) v1(52.45,36.84) v1(52.45,36.06) v1(52.45,35.19) v1(52.45,34.41) v1(53.27,36.84) v1(53.27,36.06) v1(53.27,35.19) v1(53.27,34.41) v1(54.68,12.46) v1(54.68,11.67) v1(55.5,12.46) v1(55.5,11.67) v1(56.32,12.46) v1(56.32,11.67) v1(57.22,12.46) v1(57.22,11.67) v1(58.04,12.46) v1(58.04,11.67) v1(58.86,12.46) v1(58.86,11.67) v1(68.4,17.41) v1(68.4,16.63) v1(69.22,17.41) v1(69.22,16.63) v1(70.03,17.41) v1(70.03,16.63) v1(71.95,32.14) v1(71.95,31.36) v1(71.95,30.49) v1(71.95,29.71) v1(71.95,28.84) v1(71.95,28.06) v1(71.95,27.19) v1(71.95,26.4) v1(72.77,32.14) v1(72.77,31.36) v1(72.77,30.49) v1(72.77,29.71) v1(72.77,28.84) v1(72.77,28.06) v1(72.77,27.19) v1(72.77,26.4) v1(73.59,32.14) v1(73.59,31.36) v1(73.59,30.49) v1(73.59,29.71) v1(73.59,28.84) v1(73.59,28.06) v1(73.59,27.19) v1(73.59,26.4) v1(75.38,61.48) v1(76.2,61.48) v1(76.2,60.69) v1(77.02,61.48) v1(77.02,60.69) v1(85.97,53.02) v1(91.51,63.77) v1(91.51,62.98) v1(92.33,63.77) v1(92.33,62.98) v1(93.15,63.77) v1(93.15,62.98) v1(94.18,63.77) v1(94.18,62.98) v1(95,63.77) v1(95,62.98) v1(95.81,63.77) v1(95.81,62.98) v1(98.75,39.64) v1(98.75,38.85) v1(98.75,35.32) v1(98.75,34.53) v1(98.75,28.21) v1(98.75,27.42) v1(98.75,14.11) v1(98.75,13.32) v1(98.75,12.46) v1(98.75,11.67) v1(98.88,47.26) v1(98.88,46.47) v1(99.57,39.64) v1(99.57,38.85) v1(99.57,35.32) v1(99.57,34.53) v1(99.57,28.21) v1(99.57,27.42) v1(99.57,14.11) v1(99.57,13.32) v1(99.57,12.46) v1(99.57,11.67) v1(99.69,47.26) v1(99.69,46.47) v1(100.39,39.64) v1(100.39,38.85) v1(100.39,35.32) v1(100.39,34.53) v1(100.39,28.21) v1(100.39,27.42) v1(100.39,14.11) v1(100.39,13.32) v1(100.39,12.46) v1(100.39,11.67) v1(100.51,47.26) v1(100.51,46.47) v1(107.64,63.77) v1(107.64,62.98) v1(108.46,63.77) v1(108.46,62.98) v1(109.28,63.77) v1(109.28,62.98)
VBAT: length 56.7
  Top Layer w0.508: v1(30.1,29.46) 30.11,29.47 Q2.3 30.11,34.82 R36.2 ; U6.5 7.12,30.62 v1(7.11,30.61) 6.1,31.62 C6.2
  Top Layer w0.762: CN2.1 3.4,36.46 3.4,41.04 ; 3.4,41.04 C6.2 ; 3.4,41.04 C5.2
  Bottom Layer w0.508: v1(7.11,30.61) 8.25,29.46 v1(30.1,29.46)
VBUS: length 57.4
  Top Layer w0.508: v1(44.96,9.4) 44.96,7.8 44.9,7.75 ; Q1.3 27.57,51.18 v1(28.71,51.18) ; v1(40.13,9.4) 40.13,7.78
  Bottom Layer w0.508: v1(28.71,51.18) 28.71,40.25 37.08,31.88 37.08,9.91 37.59,9.4 v1(40.13,9.4) v1(44.96,9.4)
VDD: length 250.8
  Top Layer w0.355: U8.8 99.06,56.78 C16.1 98.41,58.67 85.72,58.67 84.34,57.29 R41.2 83.82,56.4 CN8.6 81.24,56.39 v1(79.76,56.39)
  Top Layer w0.508: R13.2 60.71,37.67 v1(60.71,35.56) ; R19.2 53.09,19.93 R18.2 ; 61.34,19.8 R15.2 R14.2 ; C11.2 11.05,8.53 L1.2 ; 33.78,14.48 U4.16 40.51,14.48 v1(41.53,15.49) ; R39.2 R38.2 ; R14.2 70.25,19.8 71.25,18.8 71.25,9.4 ; R14.2 v1(66.29,22.99) ; R12.2 35.69,56.5 36.14,56.05 U3.2 41.84,56.05 42.35,55.54 44.28,55.54 45.09,54.74 ; U4.4 44.32,18.29 v1(43.94,17.91) ; 53.21,19.69 52.71,19.69 v1(50.93,17.91) 50.93,10.79 52.45,9.27 71.01,9.27 R43.2 71.39,5.1 U10.3 ; 61.72,24.72 v1(61.72,27.56)
  Top Layer w0.762: L1.2 12.19,14.23 13.46,12.95 32.26,12.95 34.8,15.49 34.8,23.35 C13.2 34.8,23.38 34.8,32.64 35.78,33.62 LD3.2 35.91,35.56 35.91,36.92 37.97,38.99 41.78,38.99 42.93,40.13 42.93,40.77 45.09,42.93 45.09,54.74 ; v1(56.51,56.01) 55.37,54.86 44.96,54.86
  Bottom Layer w0.508: v1(60.71,35.56) 61.72,34.54 v1(61.72,27.56) v1(66.29,22.99) ; v1(41.53,15.49) v1(43.94,17.91) v1(50.93,17.91)
  Bottom Layer w0.762: v1(79.76,56.39) 79.21,56.94 v1(66.04,56.94) 65.11,56.01 v1(56.51,56.01)
ADC1: length 20.7
  Top Layer w0.508: R34.2 R35.1 C18.1 34.04,53.48 34.04,51.44 v1(33.08,50.48) ; U3.10 41.02,45.85 40.32,45.85 39.7,46.47 39.7,47.04 38.35,48.39 v1(36.7,48.39)
  Bottom Layer w0.508: v1(36.7,48.39) 35.18,48.39 v1(33.08,50.48)
ADC2: length 9
  Top Layer w0.508: U3.11 41.04,44.59 R37.2 35.15,44.59 C17.1 35.09,41.81 R36.1
D+: length 17
  Top Layer w0.254: CN3.A6 42.29,6.6 42.54,6.35 43.05,6.35 43.28,6.57 43.28,6.83 43.29,6.85 CN3.B6 43.29,19.17 43.69,19.56 U4.5
D-: length 17
  Top Layer w0.254: 42.79,8.76 42.29,8.76 41.79,8.27 CN3.B7 ; 42.79,8.76 CN3.A7 ; 42.79,8.76 42.79,19.31 44.31,20.83 U4.6
EN: length 47.6
  Top Layer w0.508: Q3.3 28.58,16.72 v1(28.58,18.03) ; 35.69,54.5 40.78,54.5 U3.3 ; R12.1 35.69,51.56 32.77,48.64 32.77,39.5 v1(29.84,36.58)
  Bottom Layer w0.508: v1(29.84,36.58) 29.84,34.04 31.5,32.39 31.5,26.8 28.58,23.88 v1(28.58,18.03)
IO0: length 50.4
  Top Layer w0.508: v1(39.24,42.04) 31.37,34.16 31.37,28.45 30.99,28.07 27.94,28.07 25.85,25.98 25.85,25.02 ; 58.68,40.89 58.42,40.64 58.15,40.64 57.02,41.77 v1(57.02,41.78) ; U3.25 58.67,40.72 R13.1
  Bottom Layer w0.508: v1(39.24,42.04) 41.53,44.32 56.01,44.32 57.02,43.31 v1(57.02,41.78)
IO2: length 20.1
  Top Layer w0.508: R20.2 55.37,21.91 R18.1 54.99,22.29 54.99,34.04 55.65,34.7 U3.24
IO4: length 65.3
  Top Layer w0.508: U3.26 60.54,42.08 62.61,40 62.61,37.21 65.91,33.91 89.53,33.91 94.23,38.61 94.23,48.64 96.27,50.67 96.27,53.59 95.63,54.23 U8.3 U8.2 91.68,55.5 R31.1
IO5: length 10.9
  Top Layer w0.508: U9.2 66.68,42.29 66.17,42.8 63.25,42.8 60.16,45.89 U3.29
IO13: length 51.6
  Top Layer w0.508: v1(51.82,32.13) 45.47,38.48 45.47,39.43 U3.16 ; v1(59.06,32.13) 60.96,32.13 73.39,19.7 R43.1 73.39,7.73 72.64,6.99 U10.2
  Bottom Layer w0.508: v1(51.82,32.13) v1(59.06,32.13)
IO14: length 33.1
  Top Layer w0.508: v1(56.77,24.64) 56.77,20.81 R17.2 ; v1(44.04,43.34) 42.78,42.08 U3.13
  Bottom Layer w0.508: v1(56.77,24.64) 56.13,24.64 44.07,36.7 44.07,43.31 v1(44.04,43.34)
IO15: length 38.7
  Top Layer w0.508: R16.1 60.19,17.8 60.12,17.73 ; 60.12,17.73 60.12,20.5 60.96,21.34 62.87,21.34 63.88,22.35 63.88,27.18 60.96,30.1 57.4,30.1 56.9,30.61 56.9,40.51 56.24,41.17 55.01,41.17 54.48,40.64 54.48,39.56 U3.23 ; 60.12,17.73 60.12,15.08
IO16: length 52.6
  Top Layer w0.508: U3.27 57.24,43.35 55.63,44.96 v1(55.63,50.8) ; R29.2 87.88,56.12 87.88,50.32 84.17,46.61 v1(80.77,46.61)
  Bottom Layer w0.508: v1(80.77,46.61) 79.5,46.61 75.31,50.8 v1(55.63,50.8)
IO17: length 52
  Top Layer w0.508: v1(88.9,36.58) 87.5,35.18 66.8,35.18 63.75,38.23 63.75,40.64 59.78,44.62 U3.28 ; v1(88.9,48.64) 88.9,52.31 R30.2
  Bottom Layer w0.508: v1(88.9,36.58) v1(88.9,48.64)
IO18: length 16.7
  Top Layer w0.508: v1(63.63,44.45) 60.92,47.16 U3.30 ; U9.5 v1(70.49,39.12)
  Bottom Layer w0.508: v1(70.49,39.12) 68.96,39.12 v1(63.63,44.45)
IO19: length 16.9
  Top Layer w0.508: U3.31 61.43,48.43 66.17,43.69 70.61,43.69 71.75,44.83 U9.9
IO21: length 20
  Top Layer w0.508: v1(67.94,44.83) U9.12 ; v1(57.15,45.59) 56.64,46.1 56.64,50.42 57.19,50.97 U3.33
  Bottom Layer w0.508: v1(57.15,45.59) 66.41,45.59 67.17,44.83 v1(67.94,44.83)
IO22: length 18.1
  Top Layer w0.508: C19.2 71.86,59.18 SW1.1 69.49,59.16 R38.1 69.49,56.28 68.2,54.99 58.97,54.99 U3.36
IO23: length 10.3
  Top Layer w0.508: U3.37 61.78,56.05 R39.1 62.63,59.16 SW2.1 64.88,59.18 C20.2
IO32: length 48
  Top Layer w0.508: 84.33,39.51 84.31,39.5 v1(81.66,39.5) ; U3.8 v1(43.94,48.43)
  Bottom Layer w0.508: v1(43.94,48.43) 74.51,48.43 81.66,41.28 v1(81.66,39.5)
IO33: length 76.3
  Top Layer w0.254: v1(80.9,12.95) 82.19,11.67 R23.2
  Top Layer w0.508: U3.9 v1(43.94,47.16)
  Bottom Layer w0.508: v1(80.9,12.95) 80.52,13.33 80.52,41.15 74.51,47.16 v1(43.94,47.16)
IO34: length 81
  Top Layer w0.254: R25.2 90.66,14.61 v1(84.33,14.61)
  Top Layer w0.508: U3.6 39.66,50.97 39.03,50.33 v1(38.1,50.33)
  Bottom Layer w0.254: v1(84.33,14.61) 81.66,11.94 62.48,11.94 38.1,36.32 v1(38.1,50.33)
IO35: length 60.7
  Top Layer w0.508: v1(82.8,27.56) 84.57,27.56 84.58,27.58 ; U3.7 v1(43.94,49.7)
  Bottom Layer w0.508: v1(43.94,49.7) 74.38,49.7 82.8,41.28 v1(82.8,27.56)
RS485+: length 11.1
  Top Layer w0.254: CN10.2 103.11,52.32 R33.1 102.35,51.83 99.95,54.23 U8.6
RS485-: length 11.1
  Top Layer w0.254: U8.7 99.95,55.5 102.35,57.9 R32.1 108.47,57.9 CN10.1
RXD0: length 45.8
  Top Layer w0.254: v1(47.88,34.54) v1(47.88,15.75) U4.2 ; v1(53.91,43.37) 53.91,51.12 55.25,52.45 58.55,52.45 U3.34
  Bottom Layer w0.254: v1(47.88,34.54) 47.88,37.34 v1(53.91,43.37)
TXD0: length 45.8
  Top Layer w0.254: v1(52.83,43.43) 52.83,52.32 54.02,53.51 U3.35 ; v1(47.12,35.18) v1(47.12,17.02) U4.3
  Bottom Layer w0.254: v1(52.83,43.43) 47.12,37.72 v1(47.12,35.18)
USR_LED: length 6.6
  Top Layer w0.508: v1(39.37,37.34) 40.95,37.34 R42.2 ; v1(39.37,40.39) 39.79,40.81 U3.14
  Bottom Layer w0.508: v1(39.37,40.39) v1(39.37,37.34)
V_EXT: length 26.3
  Top Layer w0.66: Q1.1 25.08,51.95 D1.2
  Top Layer w0.762: R1.2 17.91,61.47 CN1.1 D1.2 20.32,51.94 16.37,51.94 DC1.1
VDC: length 17.4
  Top Layer w0.508: C7.2 17.4,26.15 C8.2 U7.1 ; Q2.2 24.43,26.41 22.73,26.41
  Top Layer w0.762: 22.73,26.41 22.48,26.16 C7.2
VEXT: length 184.4
  Top Layer w0.355: R40.2 81.91,58.4 CN8.2
  Top Layer w0.508: Q1.2 25.22,50.18 R34.1 30.24,50.18 v1(32.64,52.58) ; 82.84,59.33 82.83,59.33 v1(82.8,59.31)
  Top Layer w0.762: D4.1 80.08,48.7 K1.4 ; 16.76,43.94 19.69,43.94 D1.1 20.83,45.08 25.16,45.08 25.14,45.11 Q1.2 ; 16.76,43.94 C2.1 10.78,47.5 C3.2 6.1,47.48 C4.2 ; 16.76,43.94 R6.1 16.85,37.85 D2.1 ; K4.4 83.9,37.21 D7.1 ; D6.1 83.78,24.51 K3.4 ; K2.4 81.62,9.53 D5.1
  Bottom Layer w0.508: 82.8,52.96 v1(82.8,59.31)
  Bottom Layer w0.762: K2.4 86.11,8.81 86.11,24.96 ; 86.11,24.96 86.11,36.77 ; 86.11,24.96 K3.4 ; 86.11,36.77 K4.4 ; 86.11,36.77 86.11,46.95 K1.4 84.35,51.41 82.8,52.96 57.4,52.96 53.97,56.39 36.45,56.39 v1(32.64,52.58)
$1N2320: length 3.7
  Top Layer w0.254: R3.2 44.29,11 44.29,7.75
$1N2381: length 3.6
  Top Layer w0.254: 41.29,7.75 41.29,10.76 R4.2
$1N5837: length 16.5
  Top Layer w0.508: 32.89,19.56 29.81,19.56 R11.2 29.61,19.63 Q3.2 ; U4.14 38.61,17.02 v1(36.07,19.56)
  Bottom Layer w0.508: v1(36.07,19.56) v1(32.89,19.56)
$1N5841: length 20.9
  Top Layer w0.508: v1(33.02,20.83) 31.88,20.83 31.11,21.59 31.11,24.13 29.53,25.71 Q4.2 27.44,25.71 27.13,25.41 R10.2 ; U4.13 38.61,18.29 36.07,20.83
  Bottom Layer w0.508: v1(33.02,20.83) v1(36.07,20.83)
$1N5844: length 3.3
  Top Layer w0.508: R11.1 29.67,23.29 29.15,23.81 Q4.1
$1N5846: length 5.6
  Top Layer w0.508: R10.1 27.13,14.92 Q3.1
$1N6425: length 5.7
  Top Layer w0.508: 62.32,15.08 64.61,15.08 66.29,16.76 R14.1
$1N6456: length 4.6
  Top Layer w0.508: R15.1 63.88,17.4 62.87,16.38 61.58,16.38 61.22,16.03 61.22,15.08
$1N6566: length 9.9
  Top Layer w0.508: 59.02,15.72 59.02,22.66 58.93,22.75 58.96,22.78 FB1.2
$1N6650: length 2.8
  Top Layer w0.508: 57.92,15.08 57.92,17.66 R17.1
$1N6781: length 3.4
  Top Layer w0.508: R19.1 54.62,16.13 54.62,15.08
$1N6830: length 2.9
  Top Layer w0.508: R20.1 55.72,17.45 55.72,15.08
$2N2543: length 2.6
  Top Layer w0.508: R2.2 11.3,23.51 LD2.1
$2N2544: length 2.6
  Top Layer w0.508: R5.2 8,23.63 LD1.1
$2N2545: length 3.9
  Top Layer w0.508: 10.29,30.62 10.29,29.72 8.62,28.05 R5.1
$2N2546: length 2.7
  Top Layer w0.508: R2.1 11.56,28.31 U6.7
$2N2547: length 41.6
  Top Layer w0.254: R6.2 16.34,35.31 9.27,35.31 9.02,35.56 U6.4
  Top Layer w0.508: LD1.2 LD2.2 12.83,22.82 U6.8 15,30.62 16.76,32.39 R6.2 21.64,34.88 22.73,33.79 25.7,33.79 Q2.1
$2N2548: length 2.4
  Top Layer w0.508: R7.1 11.57,36.45 U6.2
$2N8434: length 8.3
  Top Layer w0.508: R9.2 17.4,14.75 U7.5 17.49,17.8 C9.2 R8.1
$2N8460: length 2.4
  Top Layer w0.508: C9.1 R8.2
$2N8471: length 5.4
  Top Layer w0.508: U7.3 13.47,20.7 L1.1
$2N8543: length 3.1
  Top Layer w0.508: LD3.1 41.04,35.43 R42.1
$3N357: length 16.4
  Top Layer w0.508: 84.35,44 90.74,44 92.71,42.04 92.71,40.52 Q5.3
  Top Layer w0.762: 84.35,44 82.25,41.91 D4.2
$3N404: length 5.6
  Top Layer w0.508: 84.33,41.51 84.38,41.46 89.91,41.46
$3N563: length 7.1
  Top Layer w0.762: CN9.1 105.17,46.32 102.85,44
$3N568: length 14.3
  Top Layer w0.762: CN9.2 98.61,41.24 95.85,44
$3N810: length 7.9
  Top Layer w0.508: R23.1 87.32,9.67 Q6.1 93.43,11.36 R24.2
$3N823: length 15.9
  Top Layer w0.508: K2.1 91.32,9.32 Q6.3
  Top Layer w0.762: D5.2 79.57,2.22 K2.1
$3N828: length 15.6
  Bottom Layer w0.762: K2.3 102.72,10.52 105.28,13.08 CN4.1
$3N831: length 17.7
  Top Layer w0.762: K2.2 95.72,5.81 97.92,8 CN4.2
$3N1300: length 6.5
  Top Layer w0.508: R26.2 R25.1 90,15.94 Q7.1
$3N1313: length 9.2
  Top Layer w0.508: D6.2 79.75,16.89 Q7.3 84.96,19.52 K3.1
$3N1318: length 7.9
  Top Layer w0.762: K3.3 106.63,24.16 CN5.1
$3N1321: length 14.9
  Top Layer w0.762: CN5.2 107.54,17.65 98.32,17.65 K3.2
$3N1326: length 6.3
  Top Layer w0.508: 84.58,29.58 84.76,29.4 Q8.1
$3N1339: length 16.9
  Top Layer w0.508: K4.1 91,32.07 93.1,29.97 Q8.3
  Top Layer w0.762: K4.1 82.12,29.84 D7.2
$3N1344: length 7.4
  Top Layer w0.762: CN6.1 106.02,35.24 K4.3
$3N1347: length 13.9
  Top Layer w0.762: CN6.2 97.75,30.16 K4.2
$3N1624: length 2.9
  Top Layer w0.508: U8.1 92.58,56.77 92.07,57.28 R29.1
$3N1654: length 2.9
  Top Layer w0.508: U8.4 92.46,52.96 91.95,52.45 R30.1
$3N1923: length 2.1
  Top Layer w0.508: R32.2 R33.2
$3N3583: length 48.4
  Top Layer w0.508: v1(86.55,57.59) 86.34,57.39 R41.1 ; 64.36,49.42 C21.2 ; 64.36,49.42 64.36,53.57 64.77,53.97 v1(69.22,53.97) ; 64.36,49.42 C22.2 65.41,49.04 U9.14 ; R40.1 v1(87.63,60.96)
  Bottom Layer w0.508: v1(86.55,57.59) 87.63,58.67 v1(87.63,60.96) 87.63,61.85 86.74,62.74 83.44,62.74 81.53,60.83 81.53,55.5 80.01,53.97 v1(69.22,53.97)
$3N3776: length 25.8
  Top Layer w0.508: U9.3 67.94,42.29 68.45,42.8 72.9,42.8 74.8,44.7 74.8,56.9 76.81,58.9 CN8.1
$3N3780: length 27
  Top Layer w0.508: CN8.3 76.95,57.9 75.69,56.64 75.69,39.24 74.68,38.23 72.52,38.23 71.75,38.99 U9.6
$3N3785: length 19.9
  Top Layer w0.508: U9.8 73.13,46.23 v1(73.91,46.23) ; v1(76.84,43.31) 76.84,56.52 77.22,56.9 CN8.5
  Bottom Layer w0.508: v1(76.84,43.31) v1(73.91,46.23)
$3N3790: length 17
  Top Layer w0.508: v1(72.01,55.12) 72.01,52.2 69.22,49.4 U9.11 ; CN8.7 v1(78.26,55.12)
  Bottom Layer w0.508: v1(78.26,55.12) v1(72.01,55.12)

## Copper pours and planes (outline as drawn; the poured copper is in the pictures)
GND on Top Layer: 0,65.02 115,65.02 115,0 0,0
GND on Bottom Layer: 0,65 115,65 115,0 0,0
V_EXT on Top Layer: 13.59,61.98 13.59,54.23 16.13,51.69 25.4,51.69 25.53,51.82 25.53,54.36 17.91,61.98
VDC on Top Layer: 19.56,26.8 20.57,27.81 22.44,27.81 23.85,26.41 23.85,25.12 21.34,22.61 16.76,22.61 16.64,22.73 16.64,26.67 16.76,26.8
VEXT on Top Layer: 24.38,50.29 19.69,45.85 12.7,45.85 12.7,41.91 15.11,39.5 15.11,38.45 16.09,37.47 21.97,37.47 26.29,41.78 26.29,45.34 30.53,49.61 30.53,50.29
